# Altium project Module16x16_Communication_board.PrjPCB
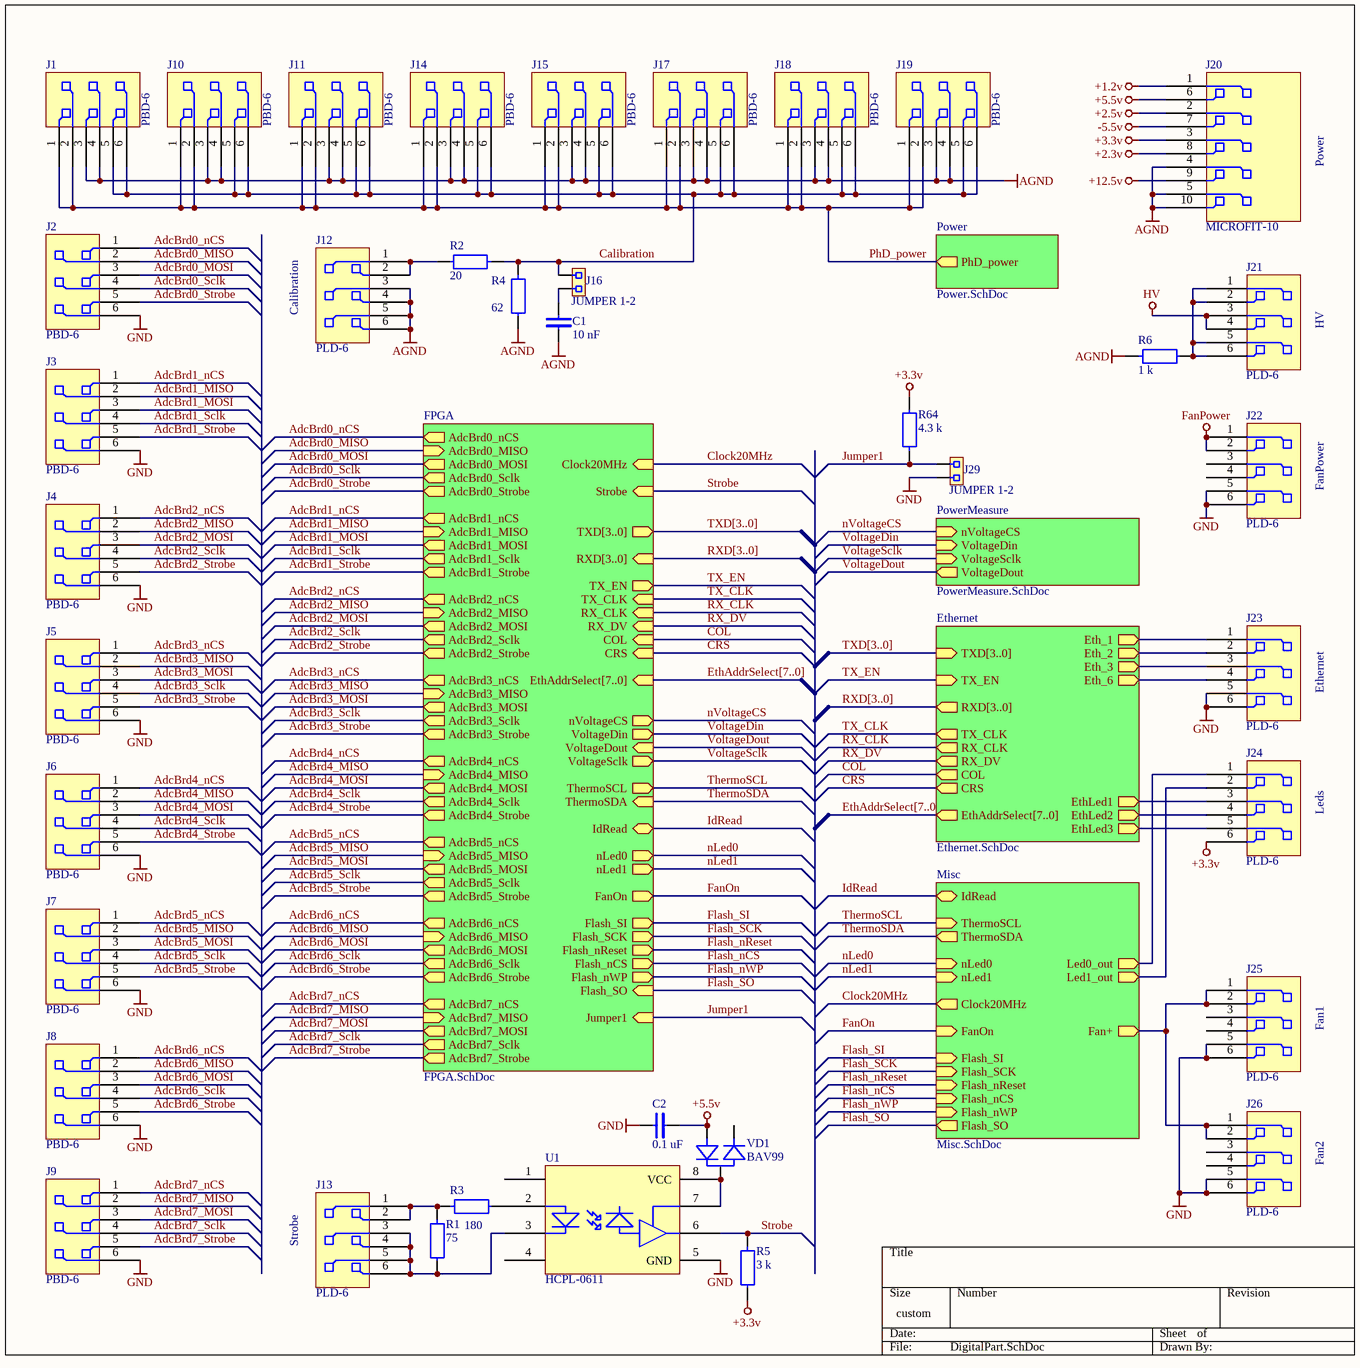
[diagram p0: DigitalPart.SchDoc]
6 sheets, 199 parts. Net scope: hierarchical (ports join the sheet entries above them; power ports are global).
Board file: Communication_board.PcbDoc
Sheets:
  DigitalPart.SchDoc
    PowerMeasure = PowerMeasure.SchDoc
    Power = Power.SchDoc
    FPGA = FPGA.SchDoc
    Ethernet = Ethernet.SchDoc
    Misc = Misc.SchDoc

## Sheet DigitalPart.SchDoc
size 254 x 254 mm; PageSetup: Record=PageOptions|CenterHorizontal=False|CenterVertical=True|PrintScale=1.00|XCorrection=1.00|YCorrection=1.00|PrintKind=2|BorderSize=5000000|LeftOffset=0|BottomOffset=0|Orientation=1|PaperLength=1000|PaperWidth=1000|Scale=100|PaperSource=7|PrintQuality=-4|MediaType=1|DitherType=10|PaperKind=A4|PrintScaleMode=0

### Parts
C1  10 nF  [1206]
C2  0.1 uF  [1206]
J1  PBD-6  [PBD-6]
J2  PBD-6  [PBD-6]
J3  PBD-6  [PBD-6]
J4  PBD-6  [PBD-6]
J5  PBD-6  [PBD-6]
J6  PBD-6  [PBD-6]
J7  PBD-6  [PBD-6]
J8  PBD-6  [PBD-6]
J9  PBD-6  [PBD-6]
J10  PBD-6  [PBD-6]
J11  PBD-6  [PBD-6]
J12  PLD-6  [PLD-6]
J13  PLD-6  [PLD-6]
J14  PBD-6  [PBD-6]
J15  PBD-6  [PBD-6]
J16  JUMPER 1-2  [2SIP]
J17  PBD-6  [PBD-6]
J18  PBD-6  [PBD-6]
J19  PBD-6  [PBD-6]
J20  MICROFIT-10  [MicroFit10]
J21  PLD-6  [PLD-6]
J22  PLD-6  [PLD-6]
J23  PLD-6  [PLD-6]
J24  PLD-6  [PLD-6]
J25  PLD-6  [PLD-6]
J26  PLD-6  [PLD-6]
J29  JUMPER 1-2  [2SIP]
R1  75  [1206]
R2  20  [1206]
R3  180  [1206]
R4  62  [1206]
R5  3 k  [1206]
R6  1 k  [1206]
R64  4.3 k  [0603]
U1  HCPL-0611  [8SOIC150]
VD1  BAV99  [SOT-23]

### Sub-sheets
Ethernet = Ethernet.SchDoc: COL (out), TX_EN (in), TX_CLK (out), RX_CLK (out), RX_DV (out), TXD[3..0] (in), RXD[3..0] (out), CRS (out), EthAddrSelect[7..0] (out), Eth_1 (out), Eth_2 (out), Eth_3 (out), Eth_6 (out), EthLed3 (out), EthLed2 (out), EthLed1 (out)
FPGA = FPGA.SchDoc: AdcBrd0_nCS (out), AdcBrd0_MISO (in), AdcBrd0_MOSI (out), AdcBrd0_Strobe (out), AdcBrd0_Sclk (out), nVoltageCS (out), VoltageDin (out), VoltageSclk (out), VoltageDout (in), COL (in), TX_EN (out), TX_CLK (in), RX_CLK (in), RX_DV (in), TXD[3..0] (out), CRS (in), RXD[3..0] (in), IdRead (bidir), ThermoSDA (in), Clock20MHz (in), ThermoSCL (out), nLed0 (out), nLed1 (out), Strobe (in), AdcBrd1_nCS (out), AdcBrd1_MISO (in), AdcBrd1_MOSI (out), AdcBrd1_Strobe (out), AdcBrd1_Sclk (out), AdcBrd2_nCS (out), AdcBrd2_MISO (in), AdcBrd2_MOSI (out), AdcBrd2_Strobe (out), AdcBrd2_Sclk (out), AdcBrd3_nCS (out), AdcBrd3_MISO (in), AdcBrd3_MOSI (out), AdcBrd3_Strobe (out), AdcBrd3_Sclk (out), AdcBrd4_nCS (out), AdcBrd4_MISO (in), AdcBrd4_MOSI (out), AdcBrd4_Strobe (out), AdcBrd4_Sclk (out), AdcBrd5_nCS (out), AdcBrd5_MISO (in), AdcBrd5_MOSI (out), AdcBrd5_Strobe (out), AdcBrd5_Sclk (out), AdcBrd6_nCS (out), AdcBrd6_MISO (in), AdcBrd6_MOSI (out), AdcBrd6_Strobe (out), AdcBrd6_Sclk (out), AdcBrd7_nCS (out), AdcBrd7_MISO (in), AdcBrd7_MOSI (out), AdcBrd7_Strobe (out), AdcBrd7_Sclk (out), EthAddrSelect[7..0] (in), FanOn (out), Flash_SI (out), Flash_SCK (out), Flash_nReset (out), Flash_nCS (out), Flash_nWP (out), Flash_SO (in), Jumper1 (in)
Misc = Misc.SchDoc: IdRead (bidir), ThermoSDA (out), Clock20MHz (out), ThermoSCL (in), nLed0 (in), nLed1 (in), Fan+ (out), FanOn (in), Flash_SI (in), Flash_SCK (in), Flash_nReset (in), Flash_nCS (in), Flash_nWP (in), Flash_SO (out), Led0_out (out), Led1_out (out)
Power = Power.SchDoc: PhD_power (out)
PowerMeasure = PowerMeasure.SchDoc: nVoltageCS (in), VoltageDin (in), VoltageSclk (in), VoltageDout (out)

### Nets
+1.2v: J20.1
+2.3v: J20.8
+2.5v: J20.2
+3.3v: J20.3 J24.6 R5.1 R64.1
+5.5v: C2.2 J20.6 VD1.1
+12.5v: J20.9
-5.5v: J20.7
AGND: C1.1 J1.3 J1.4 J10.3 J10.4 J11.3 J11.4 J12.3 J12.4 J12.5 J12.6 J14.3 J14.4 J15.3 J15.4 J17.3 J17.4 J18.3 J18.4 J19.3 J19.4 J20.4 J20.5 J20.10 R4.1 R6.2
FanPower: J22.1 J22.2
gnd: C2.1 J2.6 J3.6 J4.6 J5.6 J6.6 J7.6 J8.6 J9.6 J22.5 J22.6 J23.5 J23.6 J25.5 J25.6 J26.5 J26.6 J29.2 U1.5(GND)
HV: J21.3 J21.4
AdcBrd0_MISO: J2.2 ; sheet FPGA/AdcBrd0_MISO
AdcBrd0_MOSI: J2.3 ; sheet FPGA/AdcBrd0_MOSI
AdcBrd0_nCS: J2.1 ; sheet FPGA/AdcBrd0_nCS
AdcBrd0_Sclk: J2.4 ; sheet FPGA/AdcBrd0_Sclk
AdcBrd0_Strobe: J2.5 ; sheet FPGA/AdcBrd0_Strobe
AdcBrd1_MISO: J3.2 ; sheet FPGA/AdcBrd1_MISO
AdcBrd1_MOSI: J3.3 ; sheet FPGA/AdcBrd1_MOSI
AdcBrd1_nCS: J3.1 ; sheet FPGA/AdcBrd1_nCS
AdcBrd1_Sclk: J3.4 ; sheet FPGA/AdcBrd1_Sclk
AdcBrd1_Strobe: J3.5 ; sheet FPGA/AdcBrd1_Strobe
AdcBrd2_MISO: J4.2 ; sheet FPGA/AdcBrd2_MISO
AdcBrd2_MOSI: J4.3 ; sheet FPGA/AdcBrd2_MOSI
AdcBrd2_nCS: J4.1 ; sheet FPGA/AdcBrd2_nCS
AdcBrd2_Sclk: J4.4 ; sheet FPGA/AdcBrd2_Sclk
AdcBrd2_Strobe: J4.5 ; sheet FPGA/AdcBrd2_Strobe
AdcBrd3_MISO: J5.2 ; sheet FPGA/AdcBrd3_MISO
AdcBrd3_MOSI: J5.3 ; sheet FPGA/AdcBrd3_MOSI
AdcBrd3_nCS: J5.1 ; sheet FPGA/AdcBrd3_nCS
AdcBrd3_Sclk: J5.4 ; sheet FPGA/AdcBrd3_Sclk
AdcBrd3_Strobe: J5.5 ; sheet FPGA/AdcBrd3_Strobe
AdcBrd4_MISO: J6.2 ; sheet FPGA/AdcBrd4_MISO
AdcBrd4_MOSI: J6.3 ; sheet FPGA/AdcBrd4_MOSI
AdcBrd4_nCS: J6.1 ; sheet FPGA/AdcBrd4_nCS
AdcBrd4_Sclk: J6.4 ; sheet FPGA/AdcBrd4_Sclk
AdcBrd4_Strobe: J6.5 ; sheet FPGA/AdcBrd4_Strobe
AdcBrd5_MISO: J7.2 ; sheet FPGA/AdcBrd5_MISO
AdcBrd5_MOSI: J7.3 ; sheet FPGA/AdcBrd5_MOSI
AdcBrd5_nCS: J7.1 ; sheet FPGA/AdcBrd5_nCS
AdcBrd5_Sclk: J7.4 ; sheet FPGA/AdcBrd5_Sclk
AdcBrd5_Strobe: J7.5 ; sheet FPGA/AdcBrd5_Strobe
AdcBrd6_MISO: J8.2 ; sheet FPGA/AdcBrd6_MISO
AdcBrd6_MOSI: J8.3 ; sheet FPGA/AdcBrd6_MOSI
AdcBrd6_nCS: J8.1 ; sheet FPGA/AdcBrd6_nCS
AdcBrd6_Sclk: J8.4 ; sheet FPGA/AdcBrd6_Sclk
AdcBrd6_Strobe: J8.5 ; sheet FPGA/AdcBrd6_Strobe
AdcBrd7_MISO: J9.2 ; sheet FPGA/AdcBrd7_MISO
AdcBrd7_MOSI: J9.3 ; sheet FPGA/AdcBrd7_MOSI
AdcBrd7_nCS: J9.1 ; sheet FPGA/AdcBrd7_nCS
AdcBrd7_Sclk: J9.4 ; sheet FPGA/AdcBrd7_Sclk
AdcBrd7_Strobe: J9.5 ; sheet FPGA/AdcBrd7_Strobe
Calibration: J1.5 J1.6 J10.5 J10.6 J11.5 J11.6 J14.5 J14.6 J15.5 J15.6 J16.1 J17.5 J17.6 J18.5 J18.6 J19.5 J19.6 R2.2 R4.2
Clock20MHz: sheet FPGA/Clock20MHz, sheet Misc/Clock20MHz
COL: sheet FPGA/COL, sheet Ethernet/COL
CRS: sheet FPGA/CRS, sheet Ethernet/CRS
FanOn: sheet FPGA/FanOn, sheet Misc/FanOn
Flash_nCS: sheet FPGA/Flash_nCS, sheet Misc/Flash_nCS
Flash_nReset: sheet FPGA/Flash_nReset, sheet Misc/Flash_nReset
Flash_nWP: sheet FPGA/Flash_nWP, sheet Misc/Flash_nWP
Flash_SCK: sheet FPGA/Flash_SCK, sheet Misc/Flash_SCK
Flash_SI: sheet FPGA/Flash_SI, sheet Misc/Flash_SI
Flash_SO: sheet FPGA/Flash_SO, sheet Misc/Flash_SO
IdRead: sheet FPGA/IdRead, sheet Misc/IdRead
Jumper1: J29.1 R64.2 ; sheet FPGA/Jumper1
nLed0: sheet FPGA/nLed0, sheet Misc/nLed0
nLed1: sheet FPGA/nLed1, sheet Misc/nLed1
nVoltageCS: sheet PowerMeasure/nVoltageCS, sheet FPGA/nVoltageCS
PhD_power: J1.1 J1.2 J10.1 J10.2 J11.1 J11.2 J14.1 J14.2 J15.1 J15.2 J17.1 J17.2 J18.1 J18.2 J19.1 J19.2 ; sheet Power/PhD_power
RX_CLK: sheet FPGA/RX_CLK, sheet Ethernet/RX_CLK  [project net EthRX_CLK]
RX_DV: sheet FPGA/RX_DV, sheet Ethernet/RX_DV  [project net EthRX_DV]
Strobe: R5.2 U1.6(Out) ; sheet FPGA/Strobe
ThermoSCL: sheet FPGA/ThermoSCL, sheet Misc/ThermoSCL
ThermoSDA: sheet FPGA/ThermoSDA, sheet Misc/ThermoSDA
TX_CLK: sheet FPGA/TX_CLK, sheet Ethernet/TX_CLK  [project net EthTX_CLK]
TX_EN: sheet FPGA/TX_EN, sheet Ethernet/TX_EN  [project net EthTX_EN]
VoltageDin: sheet PowerMeasure/VoltageDin, sheet FPGA/VoltageDin
VoltageDout: sheet PowerMeasure/VoltageDout, sheet FPGA/VoltageDout
VoltageSclk: sheet PowerMeasure/VoltageSclk, sheet FPGA/VoltageSclk
NetC1_2: C1.2 J16.2
NetC40_2: J24.1 ; sheet Misc/Led0_out
NetC41_1: J24.2 ; sheet Misc/Led1_out
NetC42_+: J25.1 J25.2 J26.1 J26.2 ; sheet Misc/Fan+
NetJ12_1: J12.1 J12.2 R2.1
NetJ13_1: J13.1 J13.2 R1.2 R3.2
NetJ13_3: J13.3 J13.4 J13.5 J13.6 R1.1 U1.3(In-)
NetJ21_1: J21.1 J21.2 J21.5 J21.6 R6.1
NetJ23_1: J23.1 ; sheet Ethernet/Eth_1
NetJ23_2: J23.2 ; sheet Ethernet/Eth_2
NetJ23_3: J23.3 ; sheet Ethernet/Eth_3
NetJ23_4: J23.4 ; sheet Ethernet/Eth_6
NetJ24_3: J24.3 ; sheet Ethernet/EthLed1
NetJ24_4: J24.4 ; sheet Ethernet/EthLed2
NetJ24_5: J24.5 ; sheet Ethernet/EthLed3
NetR3_1: R3.1 U1.2(In+)
NetU1_7: U1.7(Ve) U1.8(VCC) VD1.3

Not connected (* = marked no-connect by the designer): J22 3 4; J25 3 4; J26 3 4; U1 1(NC) 4(NC); VD1 2

### Buses and harness runs
bus EthAddrSelect[7..0] = sheet Ethernet/EthAddrSelect[7..0]
bus EthAddrSelect[7..0] = sheet FPGA/EthAddrSelect[7..0]
bus RXD[3..0] = sheet Ethernet/RXD[3..0]
bus RXD[3..0] = sheet FPGA/RXD[3..0]
bus TXD[3..0] = sheet Ethernet/TXD[3..0]
bus TXD[3..0] = sheet FPGA/TXD[3..0]

### Notes on the sheet
- Power
- Calibration
- HV
- FanPower
- Ethernet
- Leds
- Fan1
- Fan2
- Strobe

### Library data of the parts
C1 C2 = C
J1-J11 J14 J15 J17-J19 = PBD-6: Socket, double line, 2.54 mm and 2 mm,
J16 J29 = JUMPER 1-2: 2.54 mm jumper
R1 R3 R5 R64 = R
R2 R4 R6 = r
VD1 = BAV99: Double diode

## Sheet PowerMeasure.SchDoc
size A4; PageSetup: Record=PageOptions|CenterHorizontal=True|CenterVertical=True|PrintScale=0.96|XCorrection=1.00|YCorrection=1.00|PrintKind=2|BorderSize=5000000|LeftOffset=0|BottomOffset=0|Orientation=2|PaperLength=1000|PaperWidth=1000|Scale=100|PaperSource=7|PrintQuality=-4|MediaType=1|DitherType=10|PaperKind=A4|PrintScaleMode=1
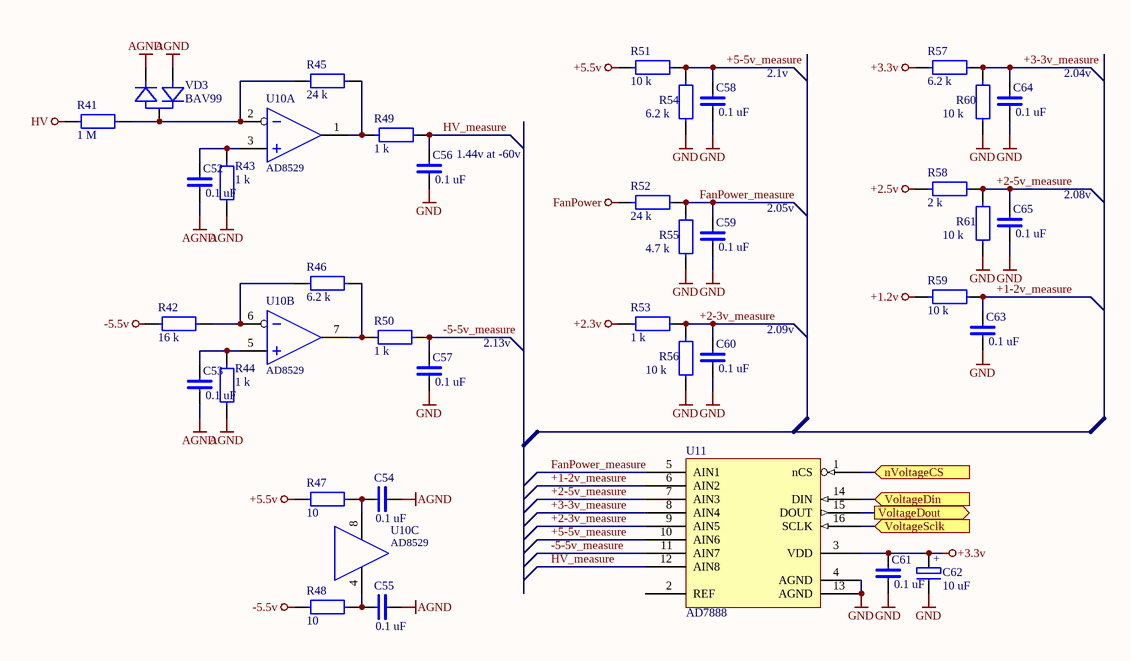
[diagram p1: PowerMeasure.SchDoc]

### Parts
C52  0.1 uF  [0603]
C53  0.1 uF  [0603]
C54  0.1 uF  [0603]
C55  0.1 uF  [0603]
C56  0.1 uF  [0603]
C57  0.1 uF  [0603]
C58  0.1 uF  [0603]
C59  0.1 uF  [0603]
C60  0.1 uF  [0603]
C61  0.1 uF  [0603]
C62  10 uF  [CP3216]
C63  0.1 uF  [0603]
C64  0.1 uF  [0603]
C65  0.1 uF  [0603]
R41  1 M  [1206]
R42  16 k  [1206]
R43  1 k  [0603]
R44  1 k  [0603]
R45  24 k  [1206]
R46  6.2 k  [1206]
R47  10  [0603]
R48  10  [0603]
R49  1 k  [0603]
R50  1 k  [0603]
R51  10 k  [0603]
R52  24 k  [1206]
R53  1 k  [0603]
R54  6.2 k  [1206]
R55  4.7 k  [1206]
R56  10 k  [0603]
R57  6.2 k  [1206]
R58  2 k  [1206]
R59  10 k  [0603]
R60  10 k  [0603]
R61  10 k  [0603]
U10  AD8529  [8SOIC150]  (parts A,B,C of 3)
U11  AD7888  [16SOIC150]
VD3  BAV99  [SOT-23]

### Ports
nVoltageCS (in), VoltageDin (in), VoltageDout (out), VoltageSclk (in)

### Nets
+1.2v: R59.2
+2.3v: R53.2
+2.5v: R58.2
+3.3v: C61.2 C62.+ R57.2 U11.3(VDD)
+5.5v: R47.1 R51.2
-5.5v: R42.1 R48.1
AGND: C52.1 C53.1 C54.1 C55.1 R43.1 R44.1 VD3.1 VD3.2
FanPower: R52.2
gnd: C56.1 C57.1 C58.1 C59.1 C60.1 C61.1 C62.- C63.1 C64.1 C65.1 R54.1 R55.1 R56.1 R60.1 R61.1 U11.4(AGND) U11.13(AGND)
HV: R41.1
+1-2v_measure: C63.2 R59.1 U11.6(AIN2)
+2-3v_measure: C60.2 R53.1 R56.2 U11.9(AIN5)
+2-5v_measure: C65.2 R58.1 R61.2 U11.7(AIN3)
+3-3v_measure: C64.2 R57.1 R60.2 U11.8(AIN4)
+5-5v_measure: C58.2 R51.1 R54.2 U11.10(AIN6)
-5-5v_measure: C57.2 R50.2 U11.11(AIN7)
FanPower_measure: C59.2 R52.1 R55.2 U11.5(AIN1)
HV_measure: C56.2 R49.1 U11.12(AIN8)
nVoltageCS: U11.1(nCS) ; port nVoltageCS
VoltageDin: U11.14(DIN) ; port VoltageDin
VoltageDout: U11.15(DOUT) ; port VoltageDout
VoltageSclk: U11.16(SCLK) ; port VoltageSclk
NetC52_2: C52.2 R43.2 U10.3(IN+)
NetC53_2: C53.2 R44.2 U10.5(IN+)
NetC54_2: C54.2 R47.2 U10.8(V+)
NetC55_2: C55.2 R48.2 U10.4(V-)
NetR41_2: R41.2 R45.1 U10.2(IN-) VD3.3
NetR42_2: R42.2 R46.1 U10.6(IN-)
NetR45_2: R45.2 R49.2 U10.1(OUT)
NetR46_2: R46.2 R50.1 U10.7(OUT)

Not connected (* = marked no-connect by the designer): U11 2(REF)

### Notes on the sheet
- 2.1v
- 2.04v
- 1.44v at -60v
- 2.05v
- 2.08v
- 2.13v
- 2.09v

### Library data of the parts
C52 C53 C56-C61 C63-C65 = C
C54 C55 = c
C62 = C POL
R41-R48 = r
R49-R61 = R
U10 = AD8529: 8 MHz Rail-to-Rail Operational Amplifiers; Value: AD8529
U11 = AD7888: 8-Channel, 125 kSPS, 12-Bit ADC; BodyName: *; Instance: *; PartName: *; PLACEMENT_REGION: *; CompValue: *; Right: *; Bottom: *; SymName: *; RefLocation: *; BoardLocation: *; SlotXofY: *
VD3 = BAV99: Double diode

## Sheet Power.SchDoc
size A4; PageSetup: Record=PageOptions|CenterHorizontal=True|CenterVertical=True|PrintScale=0.96|XCorrection=1.00|YCorrection=1.00|PrintKind=2|BorderSize=5000000|LeftOffset=0|BottomOffset=0|Orientation=2|PaperLength=1000|PaperWidth=1000|Scale=100|PaperSource=7|PrintQuality=-4|MediaType=1|DitherType=10|PaperKind=A4|PrintScaleMode=1
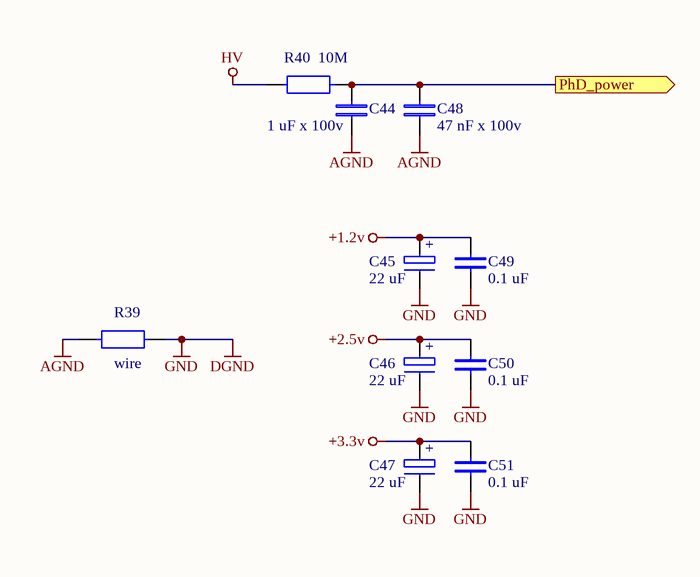
[diagram p2: Power.SchDoc]

### Parts
C44  1 uF x 100v  [CAP4]
C45  22 uF  [CP6032]
C46  22 uF  [CP6032]
C47  22 uF  [CP6032]
C48  47 nF x 100v  [1206]
C49  0.1 uF  [1206]
C50  0.1 uF  [1206]
C51  0.1 uF  [1206]
R39  wire  [1206]
R40  10M  [1206]

### Ports
PhD_power (out)

### Nets
+1.2v: C45.+ C49.2
+2.5v: C46.+ C50.2
+3.3v: C47.+ C51.2
AGND: C44.1 C48.1 R39.2
gnd: C45.- C46.- C47.- C49.1 C50.1 C51.1 R39.1  [also labelled DGND]
HV: R40.1
PhD_power: C44.2 C48.2 R40.2 ; port PhD_power

### Library data of the parts
C44 = C: K73-17
C45-C47 = C POL
C48-C51 = C
R39 R40 = R

## Sheet FPGA.SchDoc
size 635 x 381 mm
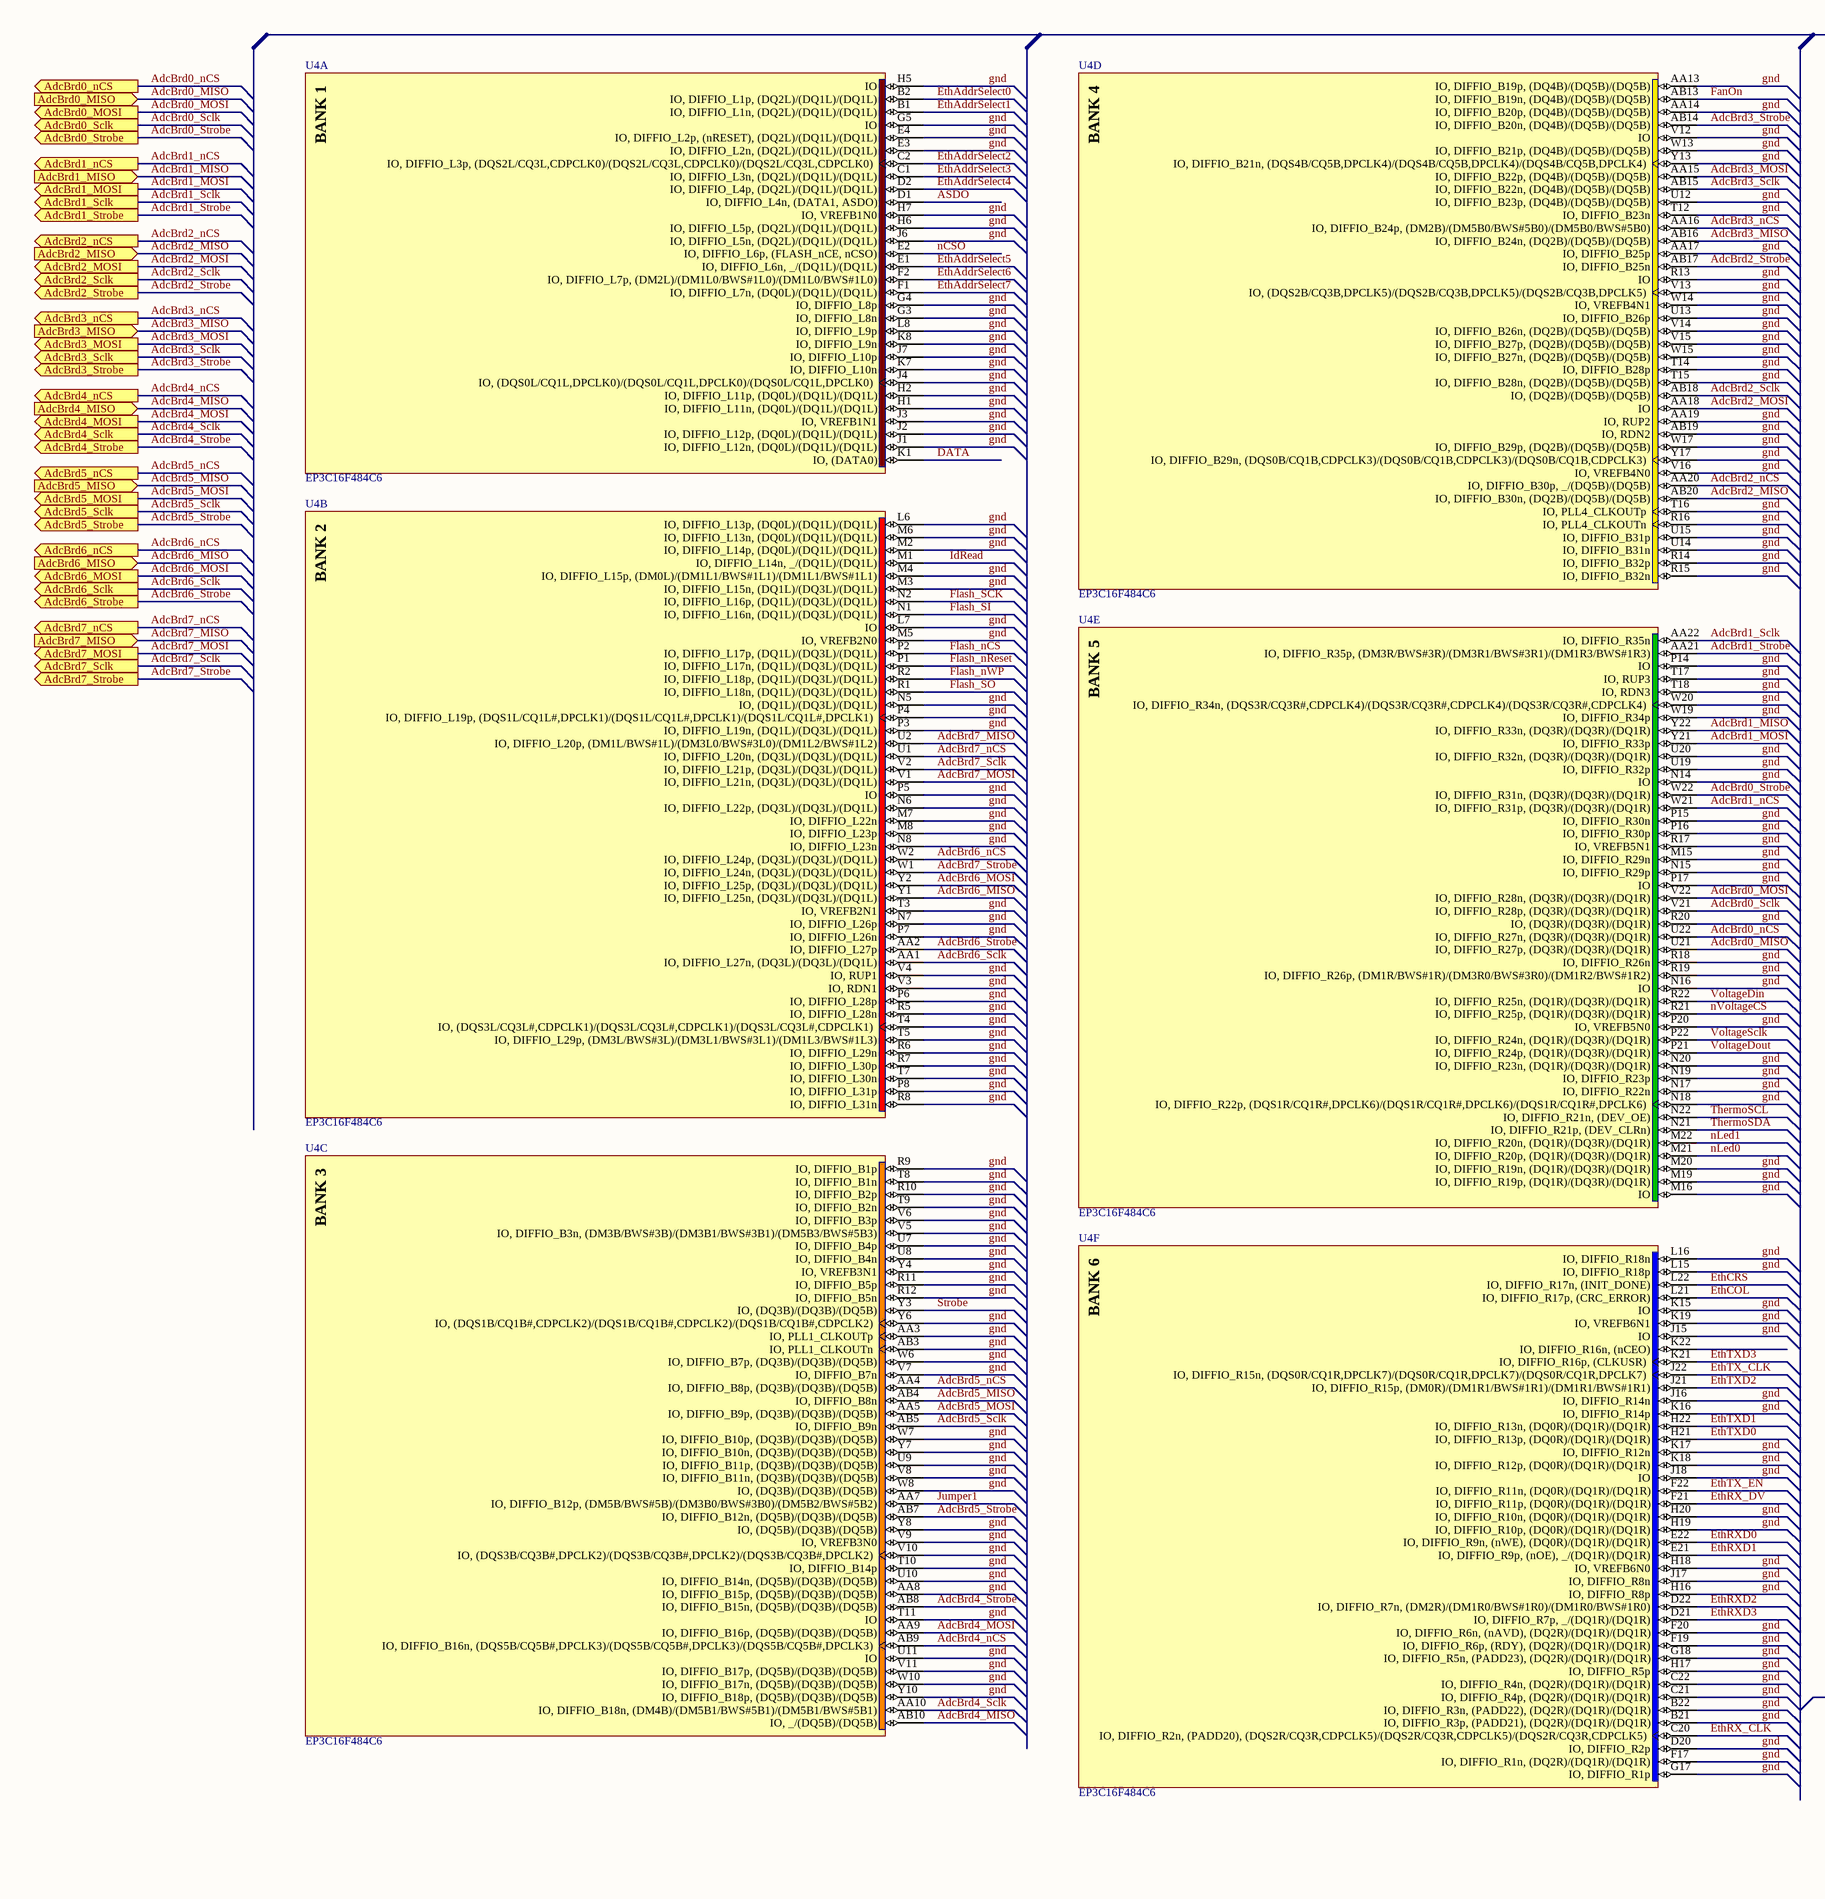
[diagram p3: FPGA.SchDoc, left]
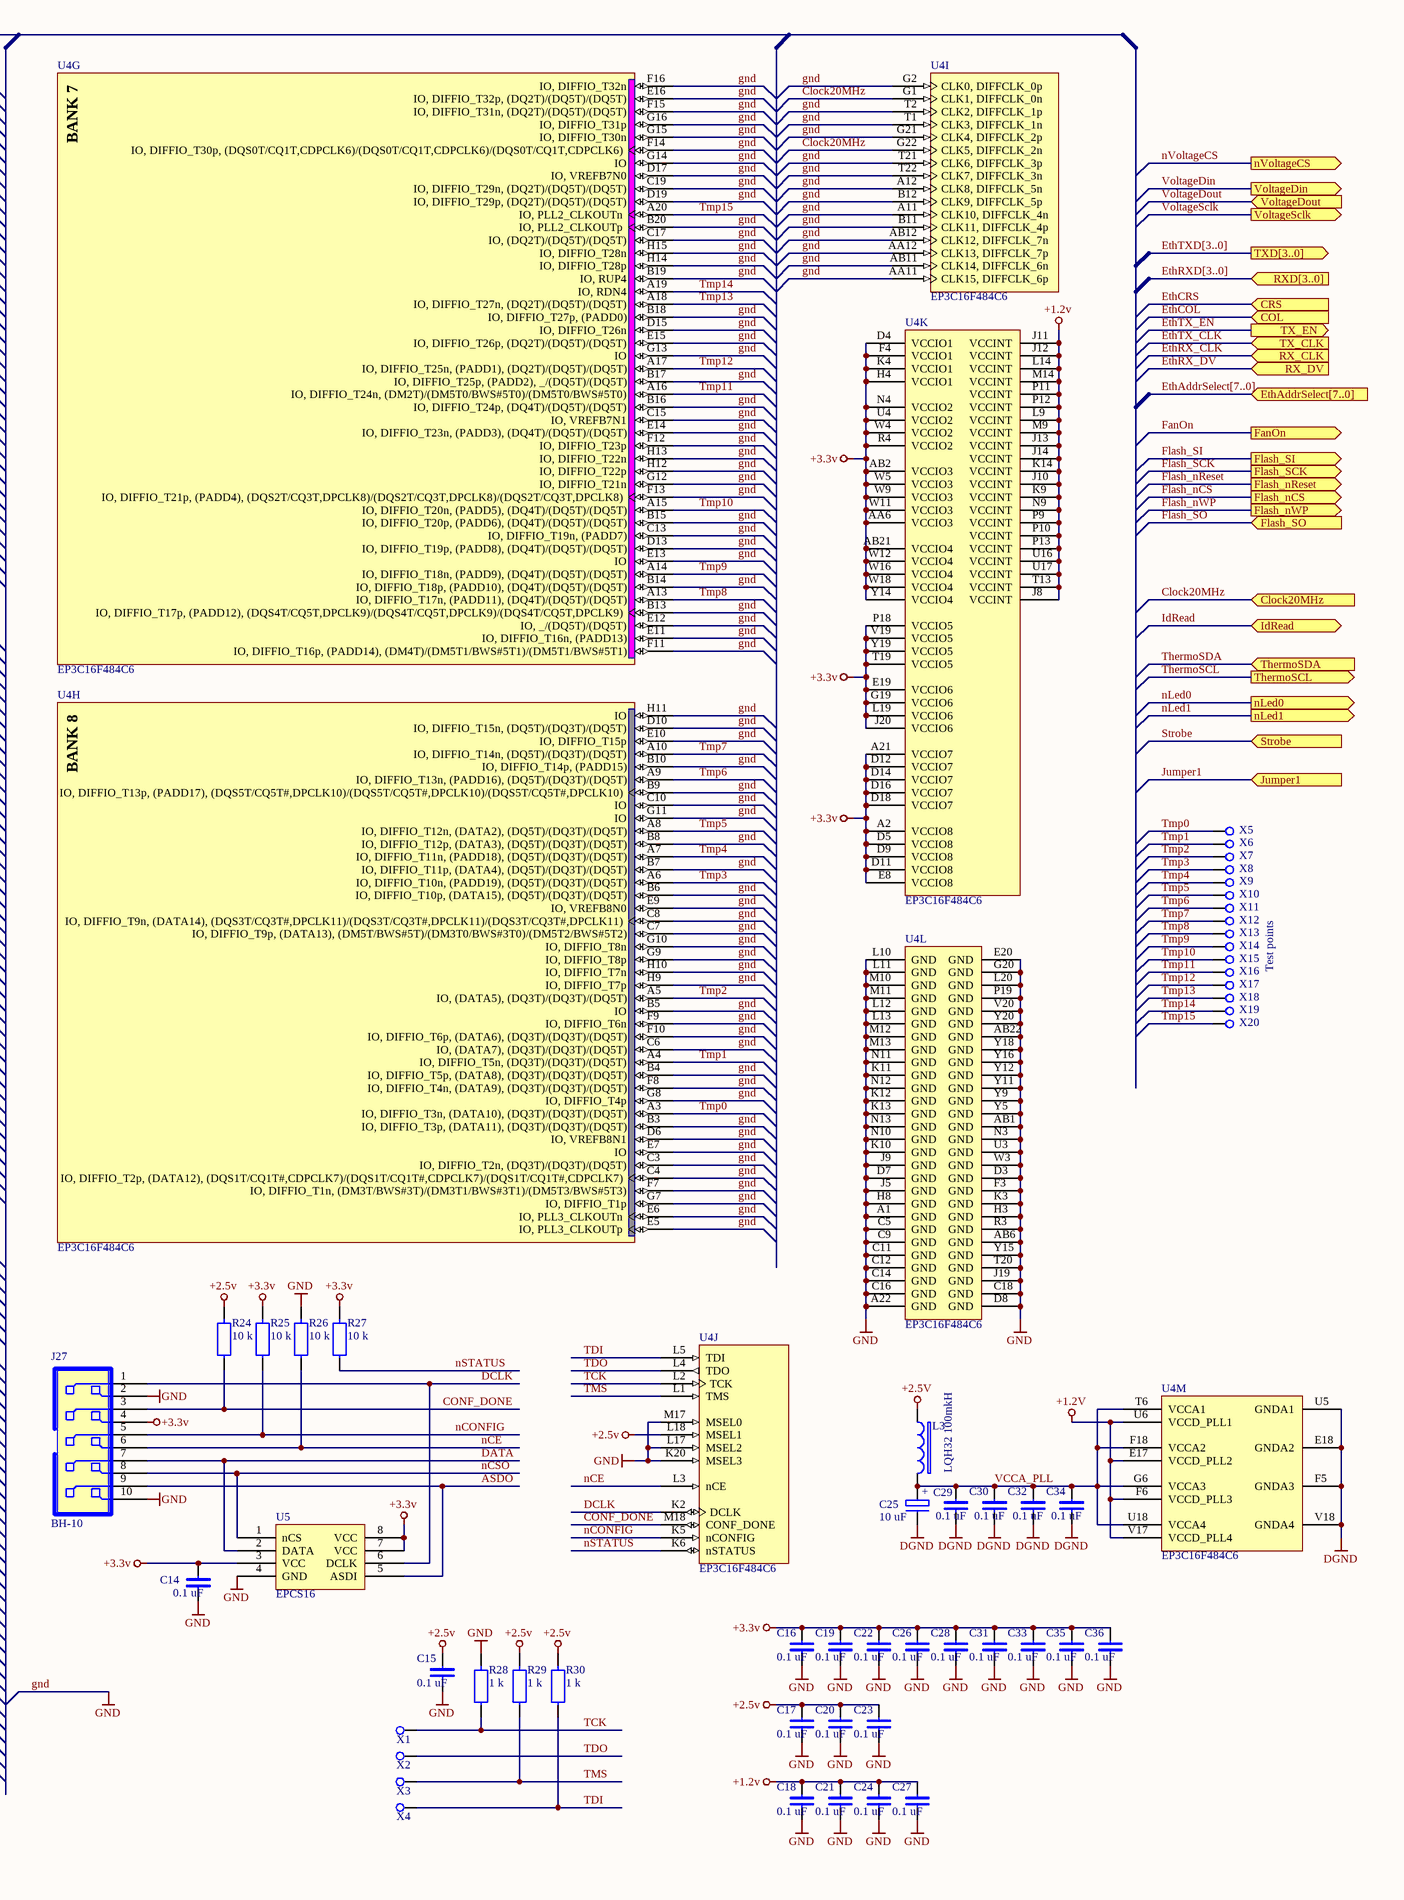
[diagram p4: FPGA.SchDoc, right]

### Parts
C14  0.1 uF  [0603]
C15  0.1 uF  [0603]
C16  0.1 uF  [0603]
C17  0.1 uF  [0603]
C18  0.1 uF  [0603]
C19  0.1 uF  [0603]
C20  0.1 uF  [0603]
C21  0.1 uF  [0603]
C22  0.1 uF  [0603]
C23  0.1 uF  [0603]
C24  0.1 uF  [0603]
C25  10 uF  [CP3216]
C26  0.1 uF  [0603]
C27  0.1 uF  [0603]
C28  0.1 uF  [0603]
C29  0.1 uF  [0603]
C30  0.1 uF  [0603]
C31  0.1 uF  [0603]
C32  0.1 uF  [0603]
C33  0.1 uF  [0603]
C34  0.1 uF  [0603]
C35  0.1 uF  [0603]
C36  0.1 uF  [0603]
J27  BH-10  [BH10]
L3  LQH32 100mkH  [1210]
R24  10 k  [0603]
R25  10 k  [0603]
R26  10 k  [0603]
R27  10 k  [0603]
R28  1 k  [0603]
R29  1 k  [0603]
R30  1 k  [0603]
U4  EP3C16F484C6  [FBGA484-3]  (parts A,B,C,D,E,F,G,H,I,J,K,L,M of 13)
U5  EPCS16  [8SOIC150]
X1  Tmp  [DRL06]  (value not drawn)
X2  Tmp  [DRL06]  (value not drawn)
X3  Tmp  [DRL06]  (value not drawn)
X4  Tmp  [DRL06]  (value not drawn)
X5  Tmp  [DRL06]  (value not drawn)
X6  Tmp  [DRL06]  (value not drawn)
X7  Tmp  [DRL06]  (value not drawn)
X8  Tmp  [DRL06]  (value not drawn)
X9  Tmp  [DRL06]  (value not drawn)
X10  Tmp  [DRL06]  (value not drawn)
X11  Tmp  [DRL06]  (value not drawn)
X12  Tmp  [DRL06]  (value not drawn)
X13  Tmp  [DRL06]  (value not drawn)
X14  Tmp  [DRL06]  (value not drawn)
X15  Tmp  [DRL06]  (value not drawn)
X16  Tmp  [DRL06]  (value not drawn)
X17  Tmp  [DRL06]  (value not drawn)
X18  Tmp  [DRL06]  (value not drawn)
X19  Tmp  [DRL06]  (value not drawn)
X20  Tmp  [DRL06]  (value not drawn)

### Ports
AdcBrd0_MISO (in), AdcBrd0_MOSI (out), AdcBrd0_nCS (out), AdcBrd0_Sclk (out), AdcBrd0_Strobe (out), AdcBrd1_MISO (in), AdcBrd1_MOSI (out), AdcBrd1_nCS (out), AdcBrd1_Sclk (out), AdcBrd1_Strobe (out), AdcBrd2_MISO (in), AdcBrd2_MOSI (out), AdcBrd2_nCS (out), AdcBrd2_Sclk (out), AdcBrd2_Strobe (out), AdcBrd3_MISO (in), AdcBrd3_MOSI (out), AdcBrd3_nCS (out), AdcBrd3_Sclk (out), AdcBrd3_Strobe (out), AdcBrd4_MISO (in), AdcBrd4_MOSI (out), AdcBrd4_nCS (out), AdcBrd4_Sclk (out), AdcBrd4_Strobe (out), AdcBrd5_MISO (in), AdcBrd5_MOSI (out), AdcBrd5_nCS (out), AdcBrd5_Sclk (out), AdcBrd5_Strobe (out), AdcBrd6_MISO (in), AdcBrd6_MOSI (out), AdcBrd6_nCS (out), AdcBrd6_Sclk (out), AdcBrd6_Strobe (out), AdcBrd7_MISO (in), AdcBrd7_MOSI (out), AdcBrd7_nCS (out), AdcBrd7_Sclk (out), AdcBrd7_Strobe (out), Clock20MHz (in), COL (in), CRS (in), EthAddrSelect[7..0] (in), FanOn (out), Flash_nCS (out), Flash_nReset (out), Flash_nWP (out), Flash_SCK (out), Flash_SI (out), Flash_SO (in), IdRead (bidir), Jumper1 (in), nLed0 (out), nLed1 (out), nVoltageCS (out), RX_CLK (in), RX_DV (in), RXD[3..0] (in), Strobe (in), ThermoSCL (out), ThermoSDA (in), TX_CLK (in), TX_EN (out), TXD[3..0] (out), VoltageDin (out), VoltageDout (in), VoltageSclk (out)

### Nets
+1.2v: C18.2 C21.2 C24.2 C27.2 U4.E17(VCCD_PLL2) U4.F6(VCCD_PLL3) U4.J8(VCCINT) U4.J10(VCCINT) U4.J11(VCCINT) U4.J12(VCCINT) U4.J13(VCCINT) U4.J14(VCCINT) U4.K9(VCCINT) U4.K14(VCCINT) U4.L9(VCCINT) U4.L14(VCCINT) U4.M9(VCCINT) U4.M14(VCCINT) U4.N9(VCCINT) U4.P9(VCCINT) U4.P10(VCCINT) U4.P11(VCCINT) U4.P12(VCCINT) U4.P13(VCCINT) U4.T13(VCCINT) U4.U6(VCCD_PLL1) U4.U16(VCCINT) U4.U17(VCCINT) U4.V17(VCCD_PLL4)
+2.5v: C15.2 C17.2 C20.2 C23.2 L3.1 R24.2 R29.2 R30.2 U4.L18(MSEL1)
+3.3v: C14.2 C16.2 C19.2 C22.2 C26.2 C28.2 C31.2 C33.2 C35.2 C36.2 J27.4 R25.2 R27.2 U4.A2(VCCIO8) U4.A21(VCCIO7) U4.AA6(VCCIO3) U4.AB2(VCCIO3) U4.AB21(VCCIO4) U4.D4(VCCIO1) U4.D5(VCCIO8) U4.D9(VCCIO8) U4.D11(VCCIO8) U4.D12(VCCIO7) U4.D14(VCCIO7) U4.D16(VCCIO7) U4.D18(VCCIO7) U4.E8(VCCIO8) U4.E19(VCCIO6) U4.F4(VCCIO1) U4.G19(VCCIO6) U4.H4(VCCIO1) U4.J20(VCCIO6) U4.K4(VCCIO1) U4.L19(VCCIO6) U4.N4(VCCIO2) U4.P18(VCCIO5) U4.R4(VCCIO2) U4.T19(VCCIO5) U4.U4(VCCIO2) U4.V19(VCCIO5) U4.W4(VCCIO2) U4.W5(VCCIO3) U4.W9(VCCIO3) U4.W11(VCCIO3) U4.W12(VCCIO4) U4.W16(VCCIO4) U4.W18(VCCIO4) U4.Y14(VCCIO4) U4.Y19(VCCIO5) U5.3(VCC) U5.7(VCC) U5.8(VCC)
gnd: C14.1 C15.1 C16.1 C17.1 C18.1 C19.1 C20.1 C21.1 C22.1 C23.1 C24.1 C25.- C26.1 C27.1 C28.1 C29.1 C30.1 C31.1 C32.1 C33.1 C34.1 C35.1 C36.1 J27.2 J27.10 R26.2 R28.2 U4.A1(GND) U4.A11(CLK10,_DIFFCLK_4n) U4.A12(CLK8,_DIFFCLK_5n) U4.A22(GND) U4.AA3(IO,_PLL1_CLKOUTp) U4.AA8(IO,_DIFFIO_B15p,_(DQ5B)/(DQ3B)/(DQ5B)) U4.AA11(CLK15,_DIFFCLK_6p) U4.AA12(CLK13,_DIFFCLK_7p) U4.AA13(IO,_DIFFIO_B19p,_(DQ4B)/(DQ5B)/(DQ5B)) U4.AA14(IO,_DIFFIO_B20p,_(DQ4B)/(DQ5B)/(DQ5B)) U4.AA17(IO,_DIFFIO_B25p) U4.AA19(IO,_RUP2) U4.AB1(GND) U4.AB3(IO,_PLL1_CLKOUTn) U4.AB6(GND) U4.AB11(CLK14,_DIFFCLK_6n) U4.AB12(CLK12,_DIFFCLK_7n) U4.AB19(IO,_RDN2) U4.AB22(GND) U4.B3(IO,_DIFFIO_T3p,_(DATA11),_(DQ3T)/(DQ3T)/(DQ5T)) U4.B4(IO,_DIFFIO_T5p,_(DATA8),_(DQ3T)/(DQ3T)/(DQ5T)) U4.B5(IO) U4.B6(IO,_DIFFIO_T10p,_(DATA15),_(DQ5T)/(DQ3T)/(DQ5T)) U4.B7(IO,_DIFFIO_T11p,_(DATA4),_(DQ5T)/(DQ3T)/(DQ5T)) U4.B8(IO,_DIFFIO_T12p,_(DATA3),_(DQ5T)/(DQ3T)/(DQ5T)) U4.B9(IO,_DIFFIO_T13p,_(PADD17),_(DQS5T/CQ5T#,DPCLK10)/(DQS5T/CQ5T#,DPCLK10)/(DQS5T/CQ5T#,DPCLK10)) U4.B10(IO,_DIFFIO_T14p,_(PADD15)) U4.B11(CLK11,_DIFFCLK_4p) U4.B12(CLK9,_DIFFCLK_5p) U4.B13(IO,_DIFFIO_T17p,_(PADD12),_(DQS4T/CQ5T,DPCLK9)/(DQS4T/CQ5T,DPCLK9)/(DQS4T/CQ5T,DPCLK9)) U4.B14(IO,_DIFFIO_T18p,_(PADD10),_(DQ4T)/(DQ5T)/(DQ5T)) U4.B15(IO,_DIFFIO_T20p,_(PADD6),_(DQ4T)/(DQ5T)/(DQ5T)) U4.B16(IO,_DIFFIO_T24p,_(DQ4T)/(DQ5T)/(DQ5T)) U4.B17(IO,_DIFFIO_T25p,_(PADD2),__/(DQ5T)/(DQ5T)) U4.B18(IO,_DIFFIO_T27p,_(PADD0)) U4.B19(IO,_RUP4) U4.B20(IO,_PLL2_CLKOUTp) U4.B21(IO,_DIFFIO_R3p,_(PADD21),_(DQ2R)/(DQ1R)/(DQ1R)) U4.B22(IO,_DIFFIO_R3n,_(PADD22),_(DQ2R)/(DQ1R)/(DQ1R)) U4.C3(IO,_DIFFIO_T2n,_(DQ3T)/(DQ3T)/(DQ5T)) U4.C4(IO,_DIFFIO_T2p,_(DATA12),_(DQS1T/CQ1T#,CDPCLK7)/(DQS1T/CQ1T#,CDPCLK7)/(DQS1T/CQ1T#,CDPCLK7)) U4.C5(GND) U4.C6(IO,_(DATA7),_(DQ3T)/(DQ3T)/(DQ5T)) U4.C7(IO,_DIFFIO_T9p,_(DATA13),_(DM5T/BWS#5T)/(DM3T0/BWS#3T0)/(DM5T2/BWS#5T2)) U4.C8(IO,_DIFFIO_T9n,_(DATA14),_(DQS3T/CQ3T#,DPCLK11)/(DQS3T/CQ3T#,DPCLK11)/(DQS3T/CQ3T#,DPCLK11)) U4.C9(GND) U4.C10(IO) U4.C11(GND) U4.C12(GND) U4.C13(IO,_DIFFIO_T19n,_(PADD7)) U4.C14(GND) U4.C15(IO,_VREFB7N1) U4.C16(GND) U4.C17(IO,_(DQ2T)/(DQ5T)/(DQ5T)) U4.C18(GND) U4.C19(IO,_DIFFIO_T29n,_(DQ2T)/(DQ5T)/(DQ5T)) U4.C21(IO,_DIFFIO_R4p,_(DQ2R)/(DQ1R)/(DQ1R)) U4.C22(IO,_DIFFIO_R4n,_(DQ2R)/(DQ1R)/(DQ1R)) U4.D3(GND) U4.D6(IO,_VREFB8N1) U4.D7(GND) U4.D8(GND) U4.D10(IO,_DIFFIO_T15n,_(DQ5T)/(DQ3T)/(DQ5T)) U4.D13(IO,_DIFFIO_T19p,_(PADD8),_(DQ4T)/(DQ5T)/(DQ5T)) U4.D15(IO,_DIFFIO_T26n) U4.D17(IO,_VREFB7N0) U4.D19(IO,_DIFFIO_T29p,_(DQ2T)/(DQ5T)/(DQ5T)) U4.D20(IO,_DIFFIO_R2p) U4.E3(IO,_DIFFIO_L2n,_(DQ2L)/(DQ1L)/(DQ1L)) U4.E4(IO,_DIFFIO_L2p,_(nRESET),_(DQ2L)/(DQ1L)/(DQ1L)) U4.E5(IO,_PLL3_CLKOUTp) U4.E6(IO,_PLL3_CLKOUTn) U4.E7(IO) U4.E9(IO,_VREFB8N0) U4.E10(IO,_DIFFIO_T15p) U4.E11(IO,_DIFFIO_T16n,_(PADD13)) U4.E12(IO,__/(DQ5T)/(DQ5T)) U4.E13(IO) U4.E14(IO,_DIFFIO_T23n,_(PADD3),_(DQ4T)/(DQ5T)/(DQ5T)) U4.E15(IO,_DIFFIO_T26p,_(DQ2T)/(DQ5T)/(DQ5T)) U4.E16(IO,_DIFFIO_T32p,_(DQ2T)/(DQ5T)/(DQ5T)) U4.E18(GNDA2) U4.E20(GND) U4.F3(GND) U4.F5(GNDA3) U4.F7(IO,_DIFFIO_T1n,_(DM3T/BWS#3T)/(DM3T1/BWS#3T1)/(DM5T3/BWS#5T3)) U4.F8(IO,_DIFFIO_T4n,_(DATA9),_(DQ3T)/(DQ3T)/(DQ5T)) U4.F9(IO,_DIFFIO_T6n) U4.F10(IO,_DIFFIO_T6p,_(DATA6),_(DQ3T)/(DQ3T)/(DQ5T)) U4.F11(IO,_DIFFIO_T16p,_(PADD14),_(DM4T)/(DM5T1/BWS#5T1)/(DM5T1/BWS#5T1)) U4.F12(IO,_DIFFIO_T23p) U4.F13(IO,_DIFFIO_T21p,_(PADD4),_(DQS2T/CQ3T,DPCLK8)/(DQS2T/CQ3T,DPCLK8)/(DQS2T/CQ3T,DPCLK8)) U4.F14(IO,_DIFFIO_T30p,_(DQS0T/CQ1T,CDPCLK6)/(DQS0T/CQ1T,CDPCLK6)/(DQS0T/CQ1T,CDPCLK6)) U4.F15(IO,_DIFFIO_T31n,_(DQ2T)/(DQ5T)/(DQ5T)) U4.F16(IO,_DIFFIO_T32n) U4.F17(IO,_DIFFIO_R1n,_(DQ2R)/(DQ1R)/(DQ1R)) U4.F19(IO,_DIFFIO_R6p,_(RDY),_(DQ2R)/(DQ1R)/(DQ1R)) U4.F20(IO,_DIFFIO_R6n,_(nAVD),_(DQ2R)/(DQ1R)/(DQ1R)) U4.G2(CLK0,_DIFFCLK_0p) U4.G3(IO,_DIFFIO_L8n) U4.G4(IO,_DIFFIO_L8p) U4.G5(IO) U4.G7(IO,_DIFFIO_T1p) U4.G8(IO,_DIFFIO_T4p) U4.G9(IO,_DIFFIO_T8p) U4.G10(IO,_DIFFIO_T8n) U4.G11(IO) U4.G12(IO,_DIFFIO_T21n) U4.G13(IO) U4.G14(IO) U4.G15(IO,_DIFFIO_T30n) U4.G16(IO,_DIFFIO_T31p) U4.G17(IO,_DIFFIO_R1p) U4.G18(IO,_DIFFIO_R5n,_(PADD23),_(DQ2R)/(DQ1R)/(DQ1R)) U4.G20(GND) U4.G21(CLK4,_DIFFCLK_2p) U4.H1(IO,_DIFFIO_L11n,_(DQ0L)/(DQ1L)/(DQ1L)) U4.H2(IO,_DIFFIO_L11p,_(DQ0L)/(DQ1L)/(DQ1L)) U4.H3(GND) U4.H5(IO) U4.H6(IO,_DIFFIO_L5p,_(DQ2L)/(DQ1L)/(DQ1L)) U4.H7(IO,_VREFB1N0) U4.H8(GND) U4.H9(IO,_DIFFIO_T7p) U4.H10(IO,_DIFFIO_T7n) U4.H11(IO) U4.H12(IO,_DIFFIO_T22p) U4.H13(IO,_DIFFIO_T22n) U4.H14(IO,_DIFFIO_T28p) U4.H15(IO,_DIFFIO_T28n) U4.H16(IO,_DIFFIO_R8p) U4.H17(IO,_DIFFIO_R5p) U4.H18(IO,_VREFB6N0) U4.H19(IO,_DIFFIO_R10p,_(DQ0R)/(DQ1R)/(DQ1R)) U4.H20(IO,_DIFFIO_R10n,_(DQ0R)/(DQ1R)/(DQ1R)) U4.J1(IO,_DIFFIO_L12n,_(DQ0L)/(DQ1L)/(DQ1L)) U4.J2(IO,_DIFFIO_L12p,_(DQ0L)/(DQ1L)/(DQ1L)) U4.J3(IO,_VREFB1N1) U4.J4(IO,_(DQS0L/CQ1L,DPCLK0)/(DQS0L/CQ1L,DPCLK0)/(DQS0L/CQ1L,DPCLK0)) U4.J5(GND) U4.J6(IO,_DIFFIO_L5n,_(DQ2L)/(DQ1L)/(DQ1L)) U4.J7(IO,_DIFFIO_L10p) U4.J9(GND) U4.J15(IO) U4.J16(IO,_DIFFIO_R14n) U4.J17(IO,_DIFFIO_R8n) U4.J18(IO) U4.J19(GND) U4.K3(GND) U4.K7(IO,_DIFFIO_L10n) U4.K8(IO,_DIFFIO_L9n) U4.K10(GND) U4.K11(GND) U4.K12(GND) U4.K13(GND) U4.K15(IO) U4.K16(IO,_DIFFIO_R14p) U4.K17(IO,_DIFFIO_R12n) U4.K18(IO,_DIFFIO_R12p,_(DQ0R)/(DQ1R)/(DQ1R)) U4.K19(IO,_VREFB6N1) U4.K20(MSEL3) U4.L6(IO,_DIFFIO_L13p,_(DQ0L)/(DQ1L)/(DQ1L)) U4.L7(IO) U4.L8(IO,_DIFFIO_L9p) U4.L10(GND) U4.L11(GND) U4.L12(GND) U4.L13(GND) U4.L15(IO,_DIFFIO_R18p) U4.L16(IO,_DIFFIO_R18n) U4.L17(MSEL2) U4.L20(GND) U4.M2(IO,_DIFFIO_L14p,_(DQ0L)/(DQ1L)/(DQ1L)) U4.M3(IO,_DIFFIO_L15n,_(DQ1L)/(DQ3L)/(DQ1L)) U4.M4(IO,_DIFFIO_L15p,_(DM0L)/(DM1L1/BWS#1L1)/(DM1L1/BWS#1L1)) U4.M5(IO,_VREFB2N0) U4.M6(IO,_DIFFIO_L13n,_(DQ0L)/(DQ1L)/(DQ1L)) U4.M7(IO,_DIFFIO_L22n) U4.M8(IO,_DIFFIO_L23p) U4.M10(GND) U4.M11(GND) U4.M12(GND) U4.M13(GND) U4.M15(IO,_DIFFIO_R29n) U4.M16(IO) U4.M17(MSEL0) U4.M19(IO,_DIFFIO_R19p,_(DQ1R)/(DQ3R)/(DQ1R)) U4.M20(IO,_DIFFIO_R19n,_(DQ1R)/(DQ3R)/(DQ1R)) U4.N3(GND) U4.N5(IO,_(DQ1L)/(DQ3L)/(DQ1L)) U4.N6(IO,_DIFFIO_L22p,_(DQ3L)/(DQ3L)/(DQ1L)) U4.N7(IO,_DIFFIO_L26p) U4.N8(IO,_DIFFIO_L23n) U4.N10(GND) U4.N11(GND) U4.N12(GND) U4.N13(GND) U4.N14(IO) U4.N15(IO,_DIFFIO_R29p) U4.N16(IO) U4.N17(IO,_DIFFIO_R22n) U4.N18(IO,_DIFFIO_R22p,_(DQS1R/CQ1R#,DPCLK6)/(DQS1R/CQ1R#,DPCLK6)/(DQS1R/CQ1R#,DPCLK6)) U4.N19(IO,_DIFFIO_R23p) U4.N20(IO,_DIFFIO_R23n,_(DQ1R)/(DQ3R)/(DQ1R)) U4.P3(IO,_DIFFIO_L19n,_(DQ1L)/(DQ3L)/(DQ1L)) U4.P4(IO,_DIFFIO_L19p,_(DQS1L/CQ1L#,DPCLK1)/(DQS1L/CQ1L#,DPCLK1)/(DQS1L/CQ1L#,DPCLK1)) U4.P5(IO) U4.P6(IO,_DIFFIO_L28p) U4.P7(IO,_DIFFIO_L26n) U4.P8(IO,_DIFFIO_L31p) U4.P14(IO) U4.P15(IO,_DIFFIO_R30n) U4.P16(IO,_DIFFIO_R30p) U4.P17(IO) U4.P19(GND) U4.P20(IO,_VREFB5N0) U4.R3(GND) U4.R5(IO,_DIFFIO_L28n) U4.R6(IO,_DIFFIO_L29n) U4.R7(IO,_DIFFIO_L30p) U4.R8(IO,_DIFFIO_L31n) U4.R9(IO,_DIFFIO_B1p) U4.R10(IO,_DIFFIO_B2p) U4.R11(IO,_DIFFIO_B5p) U4.R12(IO,_DIFFIO_B5n) U4.R13(IO) U4.R14(IO,_DIFFIO_B32p) U4.R15(IO,_DIFFIO_B32n) U4.R16(IO,_PLL4_CLKOUTn) U4.R17(IO,_VREFB5N1) U4.R18(IO,_DIFFIO_R26n) U4.R19(IO,_DIFFIO_R26p,_(DM1R/BWS#1R)/(DM3R0/BWS#3R0)/(DM1R2/BWS#1R2)) U4.R20(IO,_(DQ3R)/(DQ3R)/(DQ1R)) U4.T1(CLK3,_DIFFCLK_1n) U4.T2(CLK2,_DIFFCLK_1p) U4.T3(IO,_VREFB2N1) U4.T4(IO,_(DQS3L/CQ3L#,CDPCLK1)/(DQS3L/CQ3L#,CDPCLK1)/(DQS3L/CQ3L#,CDPCLK1)) U4.T5(IO,_DIFFIO_L29p,_(DM3L/BWS#3L)/(DM3L1/BWS#3L1)/(DM1L3/BWS#1L3)) U4.T7(IO,_DIFFIO_L30n) U4.T8(IO,_DIFFIO_B1n) U4.T9(IO,_DIFFIO_B2n) U4.T10(IO,_DIFFIO_B14p) U4.T11(IO) U4.T12(IO,_DIFFIO_B23n) U4.T14(IO,_DIFFIO_B28p) U4.T15(IO,_DIFFIO_B28n,_(DQ2B)/(DQ5B)/(DQ5B)) U4.T16(IO,_PLL4_CLKOUTp) U4.T17(IO,_RUP3) U4.T18(IO,_RDN3) U4.T20(GND) U4.T21(CLK6,_DIFFCLK_3p) U4.T22(CLK7,_DIFFCLK_3n) U4.U3(GND) U4.U5(GNDA1) U4.U7(IO,_DIFFIO_B4p) U4.U8(IO,_DIFFIO_B4n) U4.U9(IO,_DIFFIO_B11p,_(DQ3B)/(DQ3B)/(DQ5B)) U4.U10(IO,_DIFFIO_B14n,_(DQ5B)/(DQ3B)/(DQ5B)) U4.U11(IO) U4.U12(IO,_DIFFIO_B23p,_(DQ4B)/(DQ5B)/(DQ5B)) U4.U13(IO,_DIFFIO_B26p) U4.U14(IO,_DIFFIO_B31n) U4.U15(IO,_DIFFIO_B31p) U4.U19(IO,_DIFFIO_R32p) U4.U20(IO,_DIFFIO_R32n,_(DQ3R)/(DQ3R)/(DQ1R)) U4.V3(IO,_RDN1) U4.V4(IO,_RUP1) U4.V5(IO,_DIFFIO_B3n,_(DM3B/BWS#3B)/(DM3B1/BWS#3B1)/(DM5B3/BWS#5B3)) U4.V6(IO,_DIFFIO_B3p) U4.V7(IO,_DIFFIO_B7n) U4.V8(IO,_DIFFIO_B11n,_(DQ3B)/(DQ3B)/(DQ5B)) U4.V9(IO,_VREFB3N0) U4.V10(IO,_(DQS3B/CQ3B#,DPCLK2)/(DQS3B/CQ3B#,DPCLK2)/(DQS3B/CQ3B#,DPCLK2)) U4.V11(IO,_DIFFIO_B17p,_(DQ5B)/(DQ3B)/(DQ5B)) U4.V12(IO) U4.V13(IO,_(DQS2B/CQ3B,DPCLK5)/(DQS2B/CQ3B,DPCLK5)/(DQS2B/CQ3B,DPCLK5)) U4.V14(IO,_DIFFIO_B26n,_(DQ2B)/(DQ5B)/(DQ5B)) U4.V15(IO,_DIFFIO_B27p,_(DQ2B)/(DQ5B)/(DQ5B)) U4.V16(IO,_VREFB4N0) U4.V18(GNDA4) U4.V20(GND) U4.W3(GND) U4.W6(IO,_DIFFIO_B7p,_(DQ3B)/(DQ3B)/(DQ5B)) U4.W7(IO,_DIFFIO_B10p,_(DQ3B)/(DQ3B)/(DQ5B)) U4.W8(IO,_(DQ3B)/(DQ3B)/(DQ5B)) U4.W10(IO,_DIFFIO_B17n,_(DQ5B)/(DQ3B)/(DQ5B)) U4.W13(IO,_DIFFIO_B21p,_(DQ4B)/(DQ5B)/(DQ5B)) U4.W14(IO,_VREFB4N1) U4.W15(IO,_DIFFIO_B27n,_(DQ2B)/(DQ5B)/(DQ5B)) U4.W17(IO,_DIFFIO_B29p,_(DQ2B)/(DQ5B)/(DQ5B)) U4.W19(IO,_DIFFIO_R34p) U4.W20(IO,_DIFFIO_R34n,_(DQS3R/CQ3R#,CDPCLK4)/(DQS3R/CQ3R#,CDPCLK4)/(DQS3R/CQ3R#,CDPCLK4)) U4.Y4(IO,_VREFB3N1) U4.Y5(GND) U4.Y6(IO,_(DQS1B/CQ1B#,CDPCLK2)/(DQS1B/CQ1B#,CDPCLK2)/(DQS1B/CQ1B#,CDPCLK2)) U4.Y7(IO,_DIFFIO_B10n,_(DQ3B)/(DQ3B)/(DQ5B)) U4.Y8(IO,_(DQ5B)/(DQ3B)/(DQ5B)) U4.Y9(GND) U4.Y10(IO,_DIFFIO_B18p,_(DQ5B)/(DQ3B)/(DQ5B)) U4.Y11(GND) U4.Y12(GND) U4.Y13(IO,_DIFFIO_B21n,_(DQS4B/CQ5B,DPCLK4)/(DQS4B/CQ5B,DPCLK4)/(DQS4B/CQ5B,DPCLK4)) U4.Y15(GND) U4.Y16(GND) U4.Y17(IO,_DIFFIO_B29n,_(DQS0B/CQ1B,CDPCLK3)/(DQS0B/CQ1B,CDPCLK3)/(DQS0B/CQ1B,CDPCLK3)) U4.Y18(GND) U4.Y20(GND) U5.4(GND)  [also labelled DGND]
AdcBrd0_MISO: U4.U21(IO,_DIFFIO_R27p,_(DQ3R)/(DQ3R)/(DQ1R)) ; port AdcBrd0_MISO
AdcBrd0_MOSI: U4.V22(IO,_DIFFIO_R28n,_(DQ3R)/(DQ3R)/(DQ1R)) ; port AdcBrd0_MOSI
AdcBrd0_nCS: U4.U22(IO,_DIFFIO_R27n,_(DQ3R)/(DQ3R)/(DQ1R)) ; port AdcBrd0_nCS
AdcBrd0_Sclk: U4.V21(IO,_DIFFIO_R28p,_(DQ3R)/(DQ3R)/(DQ1R)) ; port AdcBrd0_Sclk
AdcBrd0_Strobe: U4.W22(IO,_DIFFIO_R31n,_(DQ3R)/(DQ3R)/(DQ1R)) ; port AdcBrd0_Strobe
AdcBrd1_MISO: U4.Y22(IO,_DIFFIO_R33n,_(DQ3R)/(DQ3R)/(DQ1R)) ; port AdcBrd1_MISO
AdcBrd1_MOSI: U4.Y21(IO,_DIFFIO_R33p) ; port AdcBrd1_MOSI
AdcBrd1_nCS: U4.W21(IO,_DIFFIO_R31p,_(DQ3R)/(DQ3R)/(DQ1R)) ; port AdcBrd1_nCS
AdcBrd1_Sclk: U4.AA22(IO,_DIFFIO_R35n) ; port AdcBrd1_Sclk
AdcBrd1_Strobe: U4.AA21(IO,_DIFFIO_R35p,_(DM3R/BWS#3R)/(DM3R1/BWS#3R1)/(DM1R3/BWS#1R3)) ; port AdcBrd1_Strobe
AdcBrd2_MISO: U4.AB20(IO,_DIFFIO_B30n,_(DQ2B)/(DQ5B)/(DQ5B)) ; port AdcBrd2_MISO
AdcBrd2_MOSI: U4.AA18(IO) ; port AdcBrd2_MOSI
AdcBrd2_nCS: U4.AA20(IO,_DIFFIO_B30p,__/(DQ5B)/(DQ5B)) ; port AdcBrd2_nCS
AdcBrd2_Sclk: U4.AB18(IO,_(DQ2B)/(DQ5B)/(DQ5B)) ; port AdcBrd2_Sclk
AdcBrd2_Strobe: U4.AB17(IO,_DIFFIO_B25n) ; port AdcBrd2_Strobe
AdcBrd3_MISO: U4.AB16(IO,_DIFFIO_B24n,_(DQ2B)/(DQ5B)/(DQ5B)) ; port AdcBrd3_MISO
AdcBrd3_MOSI: U4.AA15(IO,_DIFFIO_B22p,_(DQ4B)/(DQ5B)/(DQ5B)) ; port AdcBrd3_MOSI
AdcBrd3_nCS: U4.AA16(IO,_DIFFIO_B24p,_(DM2B)/(DM5B0/BWS#5B0)/(DM5B0/BWS#5B0)) ; port AdcBrd3_nCS
AdcBrd3_Sclk: U4.AB15(IO,_DIFFIO_B22n,_(DQ4B)/(DQ5B)/(DQ5B)) ; port AdcBrd3_Sclk
AdcBrd3_Strobe: U4.AB14(IO,_DIFFIO_B20n,_(DQ4B)/(DQ5B)/(DQ5B)) ; port AdcBrd3_Strobe
AdcBrd4_MISO: U4.AB10(IO,__/(DQ5B)/(DQ5B)) ; port AdcBrd4_MISO
AdcBrd4_MOSI: U4.AA9(IO,_DIFFIO_B16p,_(DQ5B)/(DQ3B)/(DQ5B)) ; port AdcBrd4_MOSI
AdcBrd4_nCS: U4.AB9(IO,_DIFFIO_B16n,_(DQS5B/CQ5B#,DPCLK3)/(DQS5B/CQ5B#,DPCLK3)/(DQS5B/CQ5B#,DPCLK3)) ; port AdcBrd4_nCS
AdcBrd4_Sclk: U4.AA10(IO,_DIFFIO_B18n,_(DM4B)/(DM5B1/BWS#5B1)/(DM5B1/BWS#5B1)) ; port AdcBrd4_Sclk
AdcBrd4_Strobe: U4.AB8(IO,_DIFFIO_B15n,_(DQ5B)/(DQ3B)/(DQ5B)) ; port AdcBrd4_Strobe
AdcBrd5_MISO: U4.AB4(IO,_DIFFIO_B8n) ; port AdcBrd5_MISO
AdcBrd5_MOSI: U4.AA5(IO,_DIFFIO_B9p,_(DQ3B)/(DQ3B)/(DQ5B)) ; port AdcBrd5_MOSI
AdcBrd5_nCS: U4.AA4(IO,_DIFFIO_B8p,_(DQ3B)/(DQ3B)/(DQ5B)) ; port AdcBrd5_nCS
AdcBrd5_Sclk: U4.AB5(IO,_DIFFIO_B9n) ; port AdcBrd5_Sclk
AdcBrd5_Strobe: U4.AB7(IO,_DIFFIO_B12n,_(DQ5B)/(DQ3B)/(DQ5B)) ; port AdcBrd5_Strobe
AdcBrd6_MISO: U4.Y1(IO,_DIFFIO_L25n,_(DQ3L)/(DQ3L)/(DQ1L)) ; port AdcBrd6_MISO
AdcBrd6_MOSI: U4.Y2(IO,_DIFFIO_L25p,_(DQ3L)/(DQ3L)/(DQ1L)) ; port AdcBrd6_MOSI
AdcBrd6_nCS: U4.W2(IO,_DIFFIO_L24p,_(DQ3L)/(DQ3L)/(DQ1L)) ; port AdcBrd6_nCS
AdcBrd6_Sclk: U4.AA1(IO,_DIFFIO_L27n,_(DQ3L)/(DQ3L)/(DQ1L)) ; port AdcBrd6_Sclk
AdcBrd6_Strobe: U4.AA2(IO,_DIFFIO_L27p) ; port AdcBrd6_Strobe
AdcBrd7_MISO: U4.U2(IO,_DIFFIO_L20p,_(DM1L/BWS#1L)/(DM3L0/BWS#3L0)/(DM1L2/BWS#1L2)) ; port AdcBrd7_MISO
AdcBrd7_MOSI: U4.V1(IO,_DIFFIO_L21n,_(DQ3L)/(DQ3L)/(DQ1L)) ; port AdcBrd7_MOSI
AdcBrd7_nCS: U4.U1(IO,_DIFFIO_L20n,_(DQ3L)/(DQ3L)/(DQ1L)) ; port AdcBrd7_nCS
AdcBrd7_Sclk: U4.V2(IO,_DIFFIO_L21p,_(DQ3L)/(DQ3L)/(DQ1L)) ; port AdcBrd7_Sclk
AdcBrd7_Strobe: U4.W1(IO,_DIFFIO_L24n,_(DQ3L)/(DQ3L)/(DQ1L)) ; port AdcBrd7_Strobe
ASDO: J27.9 U4.D1(IO,_DIFFIO_L4n,_(DATA1,_ASDO)) U5.5(ASDI)
Clock20MHz: U4.G1(CLK1,_DIFFCLK_0n) U4.G22(CLK5,_DIFFCLK_2n) ; port Clock20MHz
CONF_DONE: J27.3 R24.1 U4.M18(CONF_DONE)
DATA: J27.7 U4.K1(IO,_(DATA0)) U5.2(DATA)
DCLK: J27.1 U4.K2(DCLK) U5.6(DCLK)
EthAddrSelect0: U4.B2(IO,_DIFFIO_L1p,_(DQ2L)/(DQ1L)/(DQ1L))
EthAddrSelect1: U4.B1(IO,_DIFFIO_L1n,_(DQ2L)/(DQ1L)/(DQ1L))
EthAddrSelect2: U4.C2(IO,_DIFFIO_L3p,_(DQS2L/CQ3L,CDPCLK0)/(DQS2L/CQ3L,CDPCLK0)/(DQS2L/CQ3L,CDPCLK0))
EthAddrSelect3: U4.C1(IO,_DIFFIO_L3n,_(DQ2L)/(DQ1L)/(DQ1L))
EthAddrSelect4: U4.D2(IO,_DIFFIO_L4p,_(DQ2L)/(DQ1L)/(DQ1L))
EthAddrSelect5: U4.E1(IO,_DIFFIO_L6n,__/(DQ1L)/(DQ1L))
EthAddrSelect6: U4.F2(IO,_DIFFIO_L7p,_(DM2L)/(DM1L0/BWS#1L0)/(DM1L0/BWS#1L0))
EthAddrSelect7: U4.F1(IO,_DIFFIO_L7n,_(DQ0L)/(DQ1L)/(DQ1L))
EthCOL: U4.L21(IO,_DIFFIO_R17p,_(CRC_ERROR)) ; port COL  [project net COL]
EthCRS: U4.L22(IO,_DIFFIO_R17n,_(INIT_DONE)) ; port CRS  [project net CRS]
EthRX_CLK: U4.C20(IO,_DIFFIO_R2n,_(PADD20),_(DQS2R/CQ3R,CDPCLK5)/(DQS2R/CQ3R,CDPCLK5)/(DQS2R/CQ3R,CDPCLK5)) ; port RX_CLK
EthRX_DV: U4.F21(IO,_DIFFIO_R11p,_(DQ0R)/(DQ1R)/(DQ1R)) ; port RX_DV
EthRXD0: U4.E22(IO,_DIFFIO_R9n,_(nWE),_(DQ0R)/(DQ1R)/(DQ1R))
EthRXD1: U4.E21(IO,_DIFFIO_R9p,_(nOE),__/(DQ1R)/(DQ1R))
EthRXD2: U4.D22(IO,_DIFFIO_R7n,_(DM2R)/(DM1R0/BWS#1R0)/(DM1R0/BWS#1R0))
EthRXD3: U4.D21(IO,_DIFFIO_R7p,__/(DQ1R)/(DQ1R))
EthTX_CLK: U4.J22(IO,_DIFFIO_R15n,_(DQS0R/CQ1R,DPCLK7)/(DQS0R/CQ1R,DPCLK7)/(DQS0R/CQ1R,DPCLK7)) ; port TX_CLK
EthTX_EN: U4.F22(IO,_DIFFIO_R11n,_(DQ0R)/(DQ1R)/(DQ1R)) ; port TX_EN
EthTXD0: U4.H21(IO,_DIFFIO_R13p,_(DQ0R)/(DQ1R)/(DQ1R))
EthTXD1: U4.H22(IO,_DIFFIO_R13n,_(DQ0R)/(DQ1R)/(DQ1R))
EthTXD2: U4.J21(IO,_DIFFIO_R15p,_(DM0R)/(DM1R1/BWS#1R1)/(DM1R1/BWS#1R1))
EthTXD3: U4.K21(IO,_DIFFIO_R16p,_(CLKUSR))
FanOn: U4.AB13(IO,_DIFFIO_B19n,_(DQ4B)/(DQ5B)/(DQ5B)) ; port FanOn
Flash_nCS: U4.P2(IO,_DIFFIO_L17p,_(DQ1L)/(DQ3L)/(DQ1L)) ; port Flash_nCS
Flash_nReset: U4.P1(IO,_DIFFIO_L17n,_(DQ1L)/(DQ3L)/(DQ1L)) ; port Flash_nReset
Flash_nWP: U4.R2(IO,_DIFFIO_L18p,_(DQ1L)/(DQ3L)/(DQ1L)) ; port Flash_nWP
Flash_SCK: U4.N2(IO,_DIFFIO_L16p,_(DQ1L)/(DQ3L)/(DQ1L)) ; port Flash_SCK
Flash_SI: U4.N1(IO,_DIFFIO_L16n,_(DQ1L)/(DQ3L)/(DQ1L)) ; port Flash_SI
Flash_SO: U4.R1(IO,_DIFFIO_L18n,_(DQ1L)/(DQ3L)/(DQ1L)) ; port Flash_SO
IdRead: U4.M1(IO,_DIFFIO_L14n,__/(DQ1L)/(DQ1L)) ; port IdRead
Jumper1: U4.AA7(IO,_DIFFIO_B12p,_(DM5B/BWS#5B)/(DM3B0/BWS#3B0)/(DM5B2/BWS#5B2)) ; port Jumper1
nCE: J27.6 R26.1 U4.L3(nCE)
nCONFIG: J27.5 R25.1 U4.K5(nCONFIG)
nCSO: J27.8 U4.E2(IO,_DIFFIO_L6p,_(FLASH_nCE,_nCSO)) U5.1(nCS)
nLed0: U4.M21(IO,_DIFFIO_R20p,_(DQ1R)/(DQ3R)/(DQ1R)) ; port nLed0
nLed1: U4.M22(IO,_DIFFIO_R20n,_(DQ1R)/(DQ3R)/(DQ1R)) ; port nLed1
nSTATUS: R27.1 U4.K6(nSTATUS)
nVoltageCS: U4.R21(IO,_DIFFIO_R25p,_(DQ1R)/(DQ3R)/(DQ1R)) ; port nVoltageCS
Strobe: U4.Y3(IO,_(DQ3B)/(DQ3B)/(DQ5B)) ; port Strobe
TCK: R28.1 U4.L2(TCK) X1.DRIL
TDI: R30.1 U4.L5(TDI) X4.DRIL
TDO: U4.L4(TDO) X2.DRIL
ThermoSCL: U4.N22(IO,_DIFFIO_R21n,_(DEV_OE)) ; port ThermoSCL
ThermoSDA: U4.N21(IO,_DIFFIO_R21p,_(DEV_CLRn)) ; port ThermoSDA
Tmp0: U4.A3(IO,_DIFFIO_T3n,_(DATA10),_(DQ3T)/(DQ3T)/(DQ5T)) X5.DRIL
Tmp1: U4.A4(IO,_DIFFIO_T5n,_(DQ3T)/(DQ3T)/(DQ5T)) X6.DRIL
Tmp2: U4.A5(IO,_(DATA5),_(DQ3T)/(DQ3T)/(DQ5T)) X7.DRIL
Tmp3: U4.A6(IO,_DIFFIO_T10n,_(PADD19),_(DQ5T)/(DQ3T)/(DQ5T)) X8.DRIL
Tmp4: U4.A7(IO,_DIFFIO_T11n,_(PADD18),_(DQ5T)/(DQ3T)/(DQ5T)) X9.DRIL
Tmp5: U4.A8(IO,_DIFFIO_T12n,_(DATA2),_(DQ5T)/(DQ3T)/(DQ5T)) X10.DRIL
Tmp6: U4.A9(IO,_DIFFIO_T13n,_(PADD16),_(DQ5T)/(DQ3T)/(DQ5T)) X11.DRIL
Tmp7: U4.A10(IO,_DIFFIO_T14n,_(DQ5T)/(DQ3T)/(DQ5T)) X12.DRIL
Tmp8: U4.A13(IO,_DIFFIO_T17n,_(PADD11),_(DQ4T)/(DQ5T)/(DQ5T)) X13.DRIL
Tmp9: U4.A14(IO,_DIFFIO_T18n,_(PADD9),_(DQ4T)/(DQ5T)/(DQ5T)) X14.DRIL
Tmp10: U4.A15(IO,_DIFFIO_T20n,_(PADD5),_(DQ4T)/(DQ5T)/(DQ5T)) X15.DRIL
Tmp11: U4.A16(IO,_DIFFIO_T24n,_(DM2T)/(DM5T0/BWS#5T0)/(DM5T0/BWS#5T0)) X16.DRIL
Tmp12: U4.A17(IO,_DIFFIO_T25n,_(PADD1),_(DQ2T)/(DQ5T)/(DQ5T)) X17.DRIL
Tmp13: U4.A18(IO,_DIFFIO_T27n,_(DQ2T)/(DQ5T)/(DQ5T)) X18.DRIL
Tmp14: U4.A19(IO,_RDN4) X19.DRIL
Tmp15: U4.A20(IO,_PLL2_CLKOUTn) X20.DRIL
TMS: R29.1 U4.L1(TMS) X3.DRIL
VCCA_PLL: C25.+ C29.2 C30.2 C32.2 C34.2 L3.2 U4.F18(VCCA2) U4.G6(VCCA3) U4.T6(VCCA1) U4.U18(VCCA4)
VoltageDin: U4.R22(IO,_DIFFIO_R25n,_(DQ1R)/(DQ3R)/(DQ1R)) ; port VoltageDin
VoltageDout: U4.P21(IO,_DIFFIO_R24p,_(DQ1R)/(DQ3R)/(DQ1R)) ; port VoltageDout
VoltageSclk: U4.P22(IO,_DIFFIO_R24n,_(DQ1R)/(DQ3R)/(DQ1R)) ; port VoltageSclk

Not connected (* = marked no-connect by the designer): U4 K22(IO,_DIFFIO_R16n,_(nCEO))

### Buses and harness runs
bus EthAddrSelect[7..0] = port EthAddrSelect[7..0]
bus EthRXD[3..0] = port RXD[3..0]
bus EthTXD[3..0] = port TXD[3..0]

### Notes on the sheet
- Test points
- (in symbol EP3C16F484C6, part A) BANK 1
- (in symbol EP3C16F484C6, part B) BANK 2
- (in symbol EP3C16F484C6, part C) BANK 3
- (in symbol EP3C16F484C6, part D) BANK 4
- (in symbol EP3C16F484C6, part E) BANK 5
- (in symbol EP3C16F484C6, part F) BANK 6
- (in symbol EP3C16F484C6, part G) BANK 7
- (in symbol EP3C16F484C6, part H) BANK 8

### Library data of the parts
C14-C24 C26-C36 = C
C25 = C POL
L3 = DROSSEL
R24-R30 = R
U4 = EP3C16F484C6: Cyclone III Family FPGA, 346 I/O Pins, 4 PLLs, 484-Pin FBGA, Speed Grade 6, Commercial Grade; Published: 26-Feb-2007; DatasheetVersion: ver2.0, May-2008; PackageVersion: ver15.1, May-2008; PackageReference: FBGA484-3; Publisher: Altium Limited; PackageDescription: 484-Ball FineLine Ball Grid Array (FBGA484) - Option 3 - Wire Bond; Code_JEDEC: MS-034-AAJ-1; ComponentLink1Description: Manufacturer Link; ComponentLink1URL: http://www.altera.com/; ComponentLink2Description: Handbook (7.86MB); ComponentLink2URL: http://www.altera.com/literature/hb/cyc3/cyclone3_handbook.pdf; ComponentLink3Description: Packaging Specification; ComponentLink3URL: http://www.altera.com/literature/ds/dspkg.pdf
U5 = EPCS1: Serial configuration device for Cyclone (Altera)
X1-X20 = DRL

## Sheet Ethernet.SchDoc
size A4
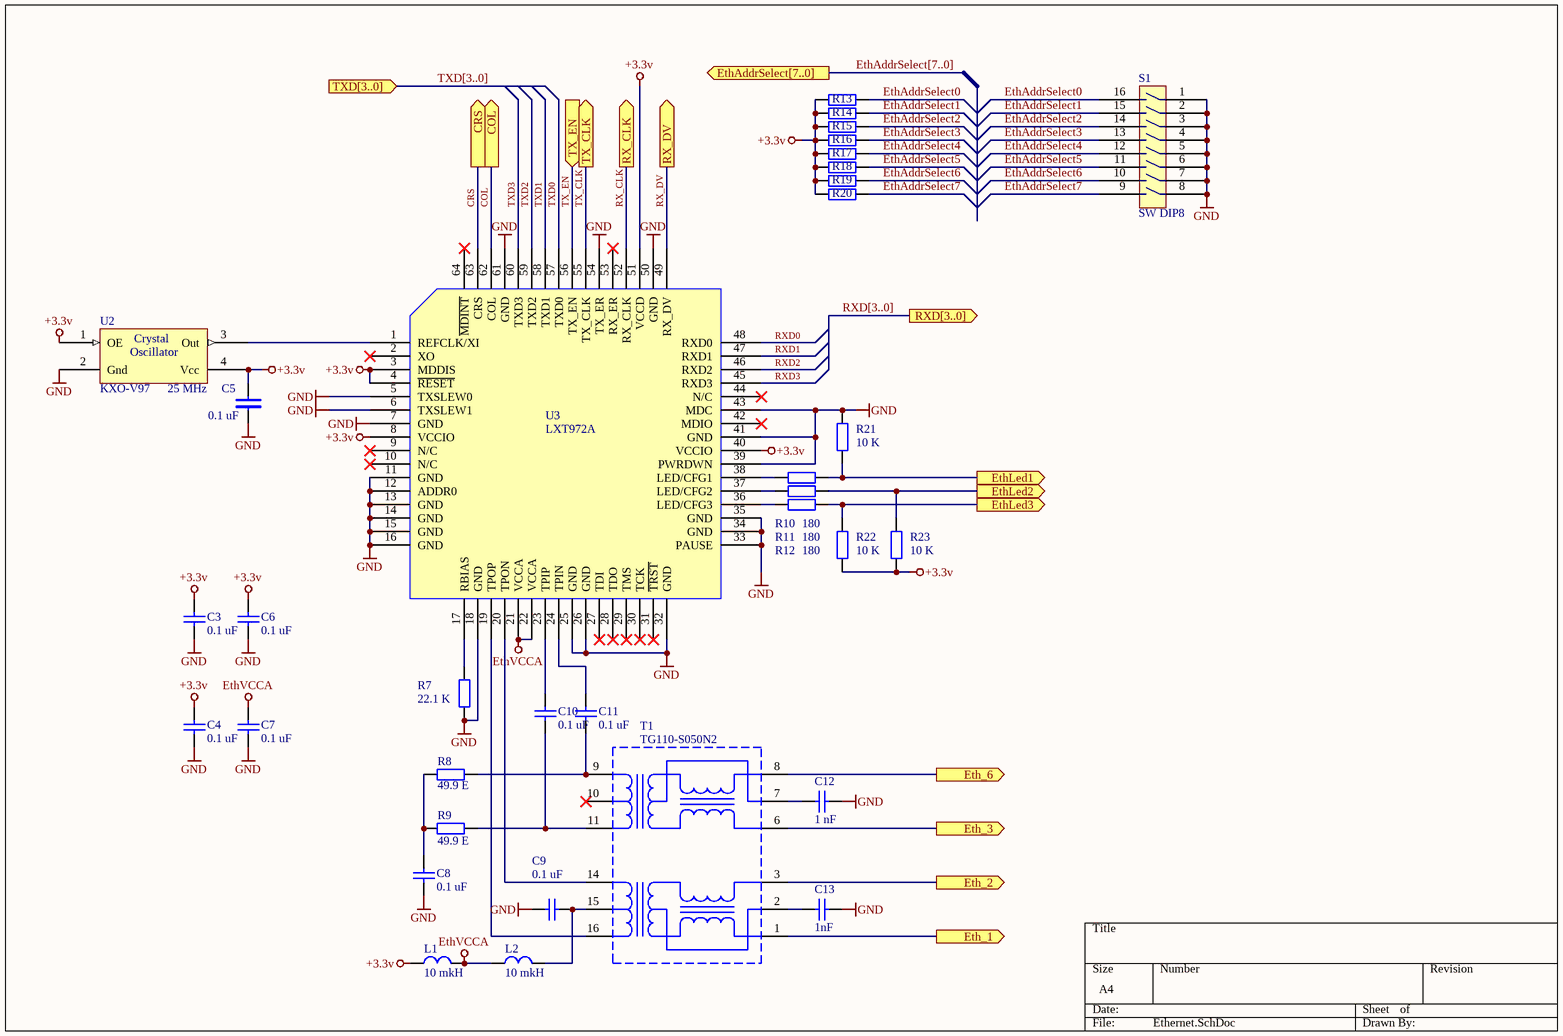
[diagram p5: Ethernet.SchDoc]

### Parts
C3  0.1 uF  [0603]
C4  0.1 uF  [0603]
C5  0.1 uF  [1206]
C6  0.1 uF  [0603]
C7  0.1 uF  [0603]
C8  0.1 uF  [0603]
C9  0.1 uF  [0603]
C10  0.1 uF  [0603]
C11  0.1 uF  [0603]
C12  1 nF  [1206]
C13  value 1nF  [1206]  (hidden comment: 1 nF)
L1  value 10 mkH  [0805]  (hidden comment: Inductor)
L2  value 10 mkH  [0805]  (hidden comment: Inductor)
R7  22.1 K  [0805]
R8  49.9 E  [0805]
R9  49.9 E  [0805]
R10  180  [0805]
R11  180  [0805]
R12  180  [0805]
R13  10 K  [0603]  (value not drawn)
R14  10 K  [0603]  (value not drawn)
R15  10 K  [0603]  (value not drawn)
R16  10 K  [0603]  (value not drawn)
R17  10 K  [0603]  (value not drawn)
R18  10 K  [0603]  (value not drawn)
R19  10 K  [0603]  (value not drawn)
R20  10 K  [0603]  (value not drawn)
R21  10 K  [0603]
R22  10 K  [0603]
R23  10 K  [0603]
S1  SW DIP8  [SWD1-8]
T1  TG110-S050N2  [SO-G16/G6.9]
U2  KXO-V97  [KXO-97]
U3  LXT972A  [TQFP64]

### Ports
COL (out), CRS (out), Eth_1 (out), Eth_2 (out), Eth_3 (out), Eth_6 (out), EthAddrSelect[7..0] (out), EthLed1 (out), EthLed2 (out), EthLed3 (out), RX_CLK (out), RX_DV (out), RXD[3..0] (out), TX_CLK (out), TX_EN (in), TXD[3..0] (in)

### Nets
+3.3v: C3.2 C4.2 C5.2 C6.2 L1.1 R13.2 R14.2 R15.2 R16.2 R17.2 R18.2 R19.2 R20.2 R22.1 R23.1 U2.1(OE) U2.4(Vcc) U3.3(MDDIS) U3.4(~{RESET}) U3.8(VCCIO) U3.40(VCCIO) U3.51(VCCD)
EthVCCA: C7.2 L1.2 L2.1 U3.21(VCCA) U3.22(VCCA)
gnd: C3.1 C4.1 C5.1 C6.1 C7.1 C8.2 C9.1 C12.2 C13.1 R7.2 R21.2 S1.1 S1.2 S1.3 S1.4 S1.5 S1.6 S1.7 S1.8 U2.2(Gnd) U3.5(TXSLEW0) U3.6(TXSLEW1) U3.7(GND) U3.11(GND) U3.12(ADDR0) U3.13(GND) U3.14(GND) U3.15(GND) U3.16(GND) U3.18(GND) U3.25(GND) U3.26(GND) U3.32(GND) U3.33(PAUSE) U3.34(GND) U3.35(GND) U3.39(PWRDWN) U3.41(GND) U3.43(MDC) U3.50(GND) U3.54(TX_ER) U3.61(GND)
COL: U3.62(COL) ; port COL
CRS: U3.63(CRS) ; port CRS
EthAddrSelect0: R13.1 S1.16
EthAddrSelect1: R14.1 S1.15
EthAddrSelect2: R15.1 S1.14
EthAddrSelect3: R16.1 S1.13
EthAddrSelect4: R17.1 S1.12
EthAddrSelect5: R18.1 S1.11
EthAddrSelect6: R19.1 S1.10
EthAddrSelect7: R20.1 S1.9
RX_CLK: U3.52(RX_CLK) ; port RX_CLK  [project net EthRX_CLK]
RX_DV: U3.49(RX_DV) ; port RX_DV  [project net EthRX_DV]
RXD0: U3.48(RXD0)  [project net EthRXD0]
RXD1: U3.47(RXD1)  [project net EthRXD1]
RXD2: U3.46(RXD2)  [project net EthRXD2]
RXD3: U3.45(RXD3)  [project net EthRXD3]
TX_CLK: U3.55(TX_CLK) ; port TX_CLK  [project net EthTX_CLK]
TX_EN: U3.56(TX_EN) ; port TX_EN  [project net EthTX_EN]
TXD0: U3.57(TXD0)  [project net EthTXD0]
TXD1: U3.58(TXD1)  [project net EthTXD1]
TXD2: U3.59(TXD2)  [project net EthTXD2]
TXD3: U3.60(TXD3)  [project net EthTXD3]
NetC8_1: C8.1 R8.1 R9.2
NetC9_2: C9.2 L2.2 T1.15
NetC10_1: C10.1 R9.1 T1.11
NetC10_2: C10.2 U3.23(TPIP)
NetC11_1: C11.1 R8.2 T1.9
NetC11_2: C11.2 U3.24(TPIN)
NetC12_1: C12.1 T1.7
NetC13_2: C13.2 T1.2
NetJ23_1: T1.1 ; port Eth_1
NetJ23_2: T1.3 ; port Eth_2
NetJ23_3: T1.6 ; port Eth_3
NetJ23_4: T1.8 ; port Eth_6
NetJ24_3: R10.2 R21.1 ; port EthLed1
NetJ24_4: R11.2 R23.2 ; port EthLed2
NetJ24_5: R12.2 R22.2 ; port EthLed3
NetR7_1: R7.1 U3.17(RBIAS)
NetR10_1: R10.1 U3.38(LED/CFG1)
NetR11_1: R11.1 U3.37(LED/CFG2)
NetR12_1: R12.1 U3.36(LED/CFG3)
NetT1_14: T1.14 U3.20(TPON)
NetT1_16: T1.16 U3.19(TPOP)
NetU2_3: U2.3(Out) U3.1(REFCLK/XI)

Not connected (* = marked no-connect by the designer): T1 10*; U3 2(XO)* 9(N/C)* 10(N/C)* 27(TDI)* 28(TDO)* 29(TMS)* 30(TCK)* 31(~{TRST})* 42(MDIO)* 44(N/C)* 53(RX_ER)* 64(~{MDINT})*

### Buses and harness runs
bus EthAddrSelect[7..0] = port EthAddrSelect[7..0]
bus RXD[3..0] = port RXD[3..0]
bus TXD[3..0] = port TXD[3..0]

### Notes on the sheet
- (near U2) 25 MHz
- (in symbol SG-636) Crystal; Oscillator

### Library data of the parts
C3 C4 C6-C13 = Cap: Capacitor; Published: 8-Jun-2000; LatestRevisionDate: 17-Jul-2002; LatestRevisionNote: Re-released for DXP Platform.; Publisher: Altium Limited
  C3 C4 C6-C11: Value: 0.1 uF
  C12: Value: 1 nF
C5 = C
L1 L2 = Inductor: Code_IEC: 1005; Published: 8-Jun-2000; LatestRevisionDate: 17-Jul-2002; LatestRevisionNote: Re-released for DXP Platform.; PackageReference: 0402-A; Publisher: Altium Limited; Code_JEITA: 0402
R7-R23 = Res2: Resistor; Published: 8-Jun-2000; LatestRevisionDate: 17-Jul-2002; LatestRevisionNote: Re-released for DXP Platform.; Publisher: Altium Limited; PackageReference: AXIAL-0.4
  R7: Value: 22.1 K
  R8 R9: Value: 49.9 E
  R10-R12: Value: 180
  R13-R23: Value: 10 K
U2 = SG-636: Crystal Oscillator (SMD)

## Sheet Misc.SchDoc
size A4; PageSetup: Record=PageOptions|CenterHorizontal=True|CenterVertical=True|PrintScale=0.96|XCorrection=1.00|YCorrection=1.00|PrintKind=2|BorderSize=5000000|LeftOffset=0|BottomOffset=0|Orientation=2|PaperLength=1000|PaperWidth=1000|Scale=100|PaperSource=7|PrintQuality=-4|MediaType=1|DitherType=10|PaperKind=A4|PrintScaleMode=1
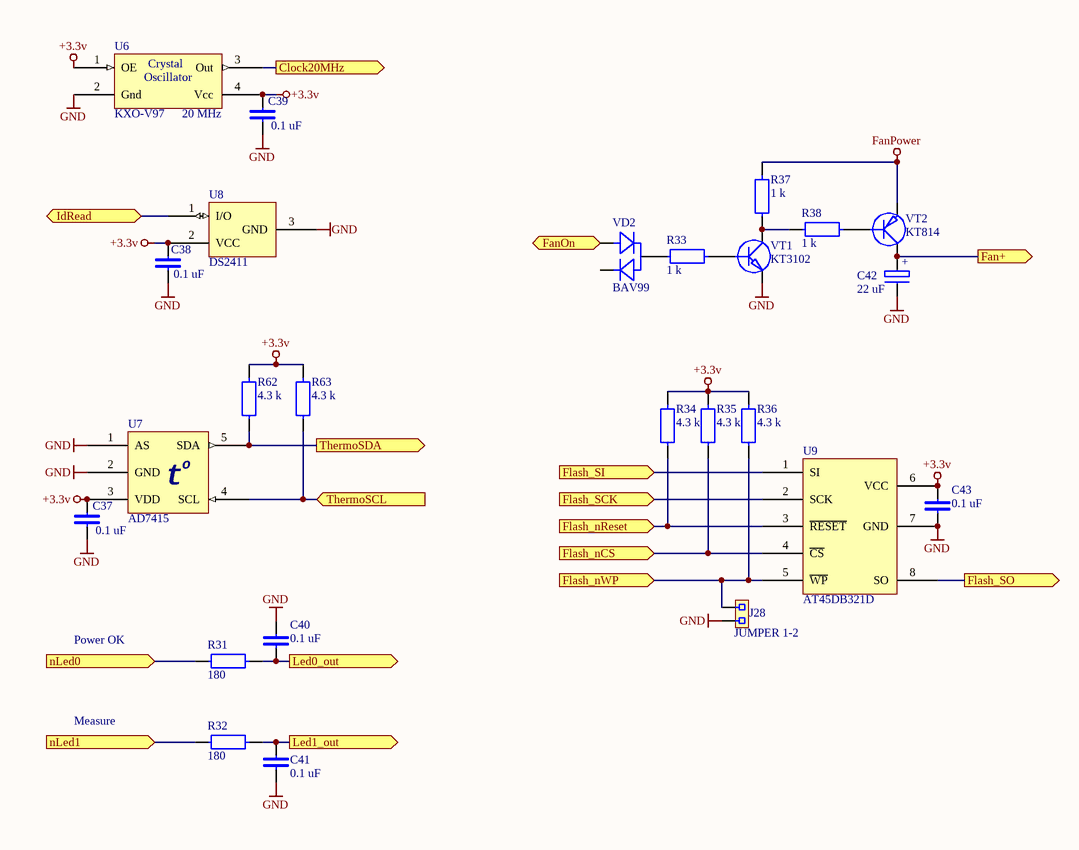
[diagram p6: Misc.SchDoc]

### Parts
C37  0.1 uF  [0603]
C38  0.1 uF  [0603]
C39  0.1 uF  [1206]
C40  0.1 uF  [1206]
C41  0.1 uF  [1206]
C42  22 uF  [CP6032]
C43  0.1 uF  [0603]
J28  JUMPER 1-2  [2SIP]
R31  180  [0805]
R32  180  [0805]
R33  1 k  [1206]
R34  4.3 k  [0603]
R35  4.3 k  [0603]
R36  4.3 k  [0603]
R37  1 k  [1206]
R38  1 k  [1206]
R62  4.3 k  [0603]
R63  4.3 k  [0603]
U6  KXO-V97  [KXO-97]
U7  AD7415  [SOT-23-5]
U8  DS2411  [SOT-23]
U9  AT45DB321D  [8SOIC208]
VD2  BAV99  [SOT-23]
VT1  KT3102  [TRANS-KT3102M]
VT2  KT814  [TRANS-KT814]

### Ports
Clock20MHz (out), Fan+ (out), FanOn (in), Flash_nCS (in), Flash_nReset (in), Flash_nWP (in), Flash_SCK (in), Flash_SI (in), Flash_SO (out), IdRead (bidir), Led0_out (out), Led1_out (out), nLed0 (in), nLed1 (in), ThermoSCL (in), ThermoSDA (out)

### Nets
+3.3v: C37.2 C38.2 C39.2 C43.1 R34.2 R35.2 R36.2 R62.2 R63.2 U6.1(OE) U6.4(Vcc) U7.3(VDD) U8.2(VCC) U9.6(VCC)
FanPower: R37.2 VT2.EMIT
gnd: C37.1 C38.1 C39.1 C40.1 C41.2 C42.- C43.2 J28.2 U6.2(Gnd) U7.1(AS) U7.2(GND) U8.3(GND) U9.7(GND) VT1.EMIT
Clock20MHz: U6.3(Out) ; port Clock20MHz
FanOn: VD2.1 ; port FanOn
Flash_nCS: R35.1 U9.4(~{CS}) ; port Flash_nCS
Flash_nReset: R34.1 U9.3(~{RESET}) ; port Flash_nReset
Flash_nWP: J28.1 R36.1 U9.5(~{WP}) ; port Flash_nWP
Flash_SCK: U9.2(SCK) ; port Flash_SCK
Flash_SI: U9.1(SI) ; port Flash_SI
Flash_SO: U9.8(SO) ; port Flash_SO
IdRead: U8.1(I/O) ; port IdRead
nLed0: R31.1 ; port nLed0
nLed1: R32.1 ; port nLed1
ThermoSCL: R63.1 U7.4(SCL) ; port ThermoSCL
ThermoSDA: R62.1 U7.5(SDA) ; port ThermoSDA
NetC40_2: C40.2 R31.2 ; port Led0_out
NetC41_1: C41.1 R32.2 ; port Led1_out
NetC42_+: C42.+ VT2.COLL ; port Fan+
NetR33_1: R33.1 VD2.3
NetR33_2: R33.2 VT1.BASE
NetR37_1: R37.1 R38.1 VT1.COLL
NetR38_2: R38.2 VT2.BASE

Not connected (* = marked no-connect by the designer): VD2 2

### Notes on the sheet
- (near U6) 20 MHz
- Power OK
- Measure
- (in symbol AD7415) o; t
- (in symbol SG-636) Crystal; Oscillator

### Library data of the parts
C37-C41 C43 = C
C42 = C POL
J28 = JUMPER 1-2: 2.54 mm jumper
R31-R38 R62 R63 = R
U6 = SG-636: Crystal Oscillator (SMD)
U7 = AD7415: 10-Bit Digital Temperature Sensors
U8 = DS2411: Silicon Serial Number
U9 = AT45DB321D: 32 Mbit data flash memory
VD2 = BAV99: Double diode

## Nets that join several sheets
+1.2v: DigitalPart (J20.1), PowerMeasure (R59.2), Power (C45.+ C49.2), FPGA (29 pins)
+2.3v: DigitalPart (J20.8), PowerMeasure (R53.2)
+2.5v: DigitalPart (J20.2), PowerMeasure (R58.2), Power (C46.+ C50.2), FPGA (9 pins)
+3.3v: DigitalPart (J20.3 J24.6 R5.1 R64.1), PowerMeasure (C61.2 C62.+ R57.2 U11.3), Power (C47.+ C51.2), FPGA (52 pins), Ethernet (22 pins), Misc (14 pins)
+5.5v: DigitalPart (C2.2 J20.6 VD1.1), PowerMeasure (R47.1 R51.2)
-5.5v: DigitalPart (J20.7), PowerMeasure (R42.1 R48.1)
AGND: DigitalPart (26 pins), PowerMeasure (8 pins), Power (C44.1 C48.1 R39.2)
FanPower: DigitalPart (J22.1 J22.2), PowerMeasure (R52.2), Misc (R37.2 VT2.EMIT)
gnd: DigitalPart (19 pins), PowerMeasure (17 pins), Power (7 pins), FPGA (335 pins), Ethernet (42 pins), Misc (14 pins)
HV: DigitalPart (J21.3 J21.4), PowerMeasure (R41.1), Power (R40.1)
AdcBrd0_MISO: DigitalPart (J2.2), FPGA (U4.U21)
AdcBrd0_MOSI: DigitalPart (J2.3), FPGA (U4.V22)
AdcBrd0_nCS: DigitalPart (J2.1), FPGA (U4.U22)
AdcBrd0_Sclk: DigitalPart (J2.4), FPGA (U4.V21)
AdcBrd0_Strobe: DigitalPart (J2.5), FPGA (U4.W22)
AdcBrd1_MISO: DigitalPart (J3.2), FPGA (U4.Y22)
AdcBrd1_MOSI: DigitalPart (J3.3), FPGA (U4.Y21)
AdcBrd1_nCS: DigitalPart (J3.1), FPGA (U4.W21)
AdcBrd1_Sclk: DigitalPart (J3.4), FPGA (U4.AA22)
AdcBrd1_Strobe: DigitalPart (J3.5), FPGA (U4.AA21)
AdcBrd2_MISO: DigitalPart (J4.2), FPGA (U4.AB20)
AdcBrd2_MOSI: DigitalPart (J4.3), FPGA (U4.AA18)
AdcBrd2_nCS: DigitalPart (J4.1), FPGA (U4.AA20)
AdcBrd2_Sclk: DigitalPart (J4.4), FPGA (U4.AB18)
AdcBrd2_Strobe: DigitalPart (J4.5), FPGA (U4.AB17)
AdcBrd3_MISO: DigitalPart (J5.2), FPGA (U4.AB16)
AdcBrd3_MOSI: DigitalPart (J5.3), FPGA (U4.AA15)
AdcBrd3_nCS: DigitalPart (J5.1), FPGA (U4.AA16)
AdcBrd3_Sclk: DigitalPart (J5.4), FPGA (U4.AB15)
AdcBrd3_Strobe: DigitalPart (J5.5), FPGA (U4.AB14)
AdcBrd4_MISO: DigitalPart (J6.2), FPGA (U4.AB10)
AdcBrd4_MOSI: DigitalPart (J6.3), FPGA (U4.AA9)
AdcBrd4_nCS: DigitalPart (J6.1), FPGA (U4.AB9)
AdcBrd4_Sclk: DigitalPart (J6.4), FPGA (U4.AA10)
AdcBrd4_Strobe: DigitalPart (J6.5), FPGA (U4.AB8)
AdcBrd5_MISO: DigitalPart (J7.2), FPGA (U4.AB4)
AdcBrd5_MOSI: DigitalPart (J7.3), FPGA (U4.AA5)
AdcBrd5_nCS: DigitalPart (J7.1), FPGA (U4.AA4)
AdcBrd5_Sclk: DigitalPart (J7.4), FPGA (U4.AB5)
AdcBrd5_Strobe: DigitalPart (J7.5), FPGA (U4.AB7)
AdcBrd6_MISO: DigitalPart (J8.2), FPGA (U4.Y1)
AdcBrd6_MOSI: DigitalPart (J8.3), FPGA (U4.Y2)
AdcBrd6_nCS: DigitalPart (J8.1), FPGA (U4.W2)
AdcBrd6_Sclk: DigitalPart (J8.4), FPGA (U4.AA1)
AdcBrd6_Strobe: DigitalPart (J8.5), FPGA (U4.AA2)
AdcBrd7_MISO: DigitalPart (J9.2), FPGA (U4.U2)
AdcBrd7_MOSI: DigitalPart (J9.3), FPGA (U4.V1)
AdcBrd7_nCS: DigitalPart (J9.1), FPGA (U4.U1)
AdcBrd7_Sclk: DigitalPart (J9.4), FPGA (U4.V2)
AdcBrd7_Strobe: DigitalPart (J9.5), FPGA (U4.W1)
Clock20MHz: FPGA (U4.G1 U4.G22), Misc (U6.3)
COL: FPGA (U4.L21), Ethernet (U3.62)
CRS: FPGA (U4.L22), Ethernet (U3.63)
EthAddrSelect0: FPGA (U4.B2), Ethernet (R13.1 S1.16)
EthAddrSelect1: FPGA (U4.B1), Ethernet (R14.1 S1.15)
EthAddrSelect2: FPGA (U4.C2), Ethernet (R15.1 S1.14)
EthAddrSelect3: FPGA (U4.C1), Ethernet (R16.1 S1.13)
EthAddrSelect4: FPGA (U4.D2), Ethernet (R17.1 S1.12)
EthAddrSelect5: FPGA (U4.E1), Ethernet (R18.1 S1.11)
EthAddrSelect6: FPGA (U4.F2), Ethernet (R19.1 S1.10)
EthAddrSelect7: FPGA (U4.F1), Ethernet (R20.1 S1.9)
EthRX_CLK: FPGA (U4.C20), Ethernet (U3.52)
EthRX_DV: FPGA (U4.F21), Ethernet (U3.49)
EthRXD0: FPGA (U4.E22), Ethernet (U3.48)
EthRXD1: FPGA (U4.E21), Ethernet (U3.47)
EthRXD2: FPGA (U4.D22), Ethernet (U3.46)
EthRXD3: FPGA (U4.D21), Ethernet (U3.45)
EthTX_CLK: FPGA (U4.J22), Ethernet (U3.55)
EthTX_EN: FPGA (U4.F22), Ethernet (U3.56)
EthTXD0: FPGA (U4.H21), Ethernet (U3.57)
EthTXD1: FPGA (U4.H22), Ethernet (U3.58)
EthTXD2: FPGA (U4.J21), Ethernet (U3.59)
EthTXD3: FPGA (U4.K21), Ethernet (U3.60)
FanOn: FPGA (U4.AB13), Misc (VD2.1)
Flash_nCS: FPGA (U4.P2), Misc (R35.1 U9.4)
Flash_nReset: FPGA (U4.P1), Misc (R34.1 U9.3)
Flash_nWP: FPGA (U4.R2), Misc (J28.1 R36.1 U9.5)
Flash_SCK: FPGA (U4.N2), Misc (U9.2)
Flash_SI: FPGA (U4.N1), Misc (U9.1)
Flash_SO: FPGA (U4.R1), Misc (U9.8)
IdRead: FPGA (U4.M1), Misc (U8.1)
Jumper1: DigitalPart (J29.1 R64.2), FPGA (U4.AA7)
NetC40_2: DigitalPart (J24.1), Misc (C40.2 R31.2)
NetC41_1: DigitalPart (J24.2), Misc (C41.1 R32.2)
NetC42_+: DigitalPart (J25.1 J25.2 J26.1 J26.2), Misc (C42.+ VT2.COLL)
NetJ23_1: DigitalPart (J23.1), Ethernet (T1.1)
NetJ23_2: DigitalPart (J23.2), Ethernet (T1.3)
NetJ23_3: DigitalPart (J23.3), Ethernet (T1.6)
NetJ23_4: DigitalPart (J23.4), Ethernet (T1.8)
NetJ24_3: DigitalPart (J24.3), Ethernet (R10.2 R21.1)
NetJ24_4: DigitalPart (J24.4), Ethernet (R11.2 R23.2)
NetJ24_5: DigitalPart (J24.5), Ethernet (R12.2 R22.2)
nLed0: FPGA (U4.M21), Misc (R31.1)
nLed1: FPGA (U4.M22), Misc (R32.1)
nVoltageCS: PowerMeasure (U11.1), FPGA (U4.R21)
PhD_power: DigitalPart (16 pins), Power (C44.2 C48.2 R40.2)
Strobe: DigitalPart (R5.2 U1.6), FPGA (U4.Y3)
ThermoSCL: FPGA (U4.N22), Misc (R63.1 U7.4)
ThermoSDA: FPGA (U4.N21), Misc (R62.1 U7.5)
VoltageDin: PowerMeasure (U11.14), FPGA (U4.R22)
VoltageDout: PowerMeasure (U11.15), FPGA (U4.P21)
VoltageSclk: PowerMeasure (U11.16), FPGA (U4.P22)